# EAGLE design CoCoSDCExt (EAGLE 7.7.0)

## Sheet 1 of 4: LOGIC
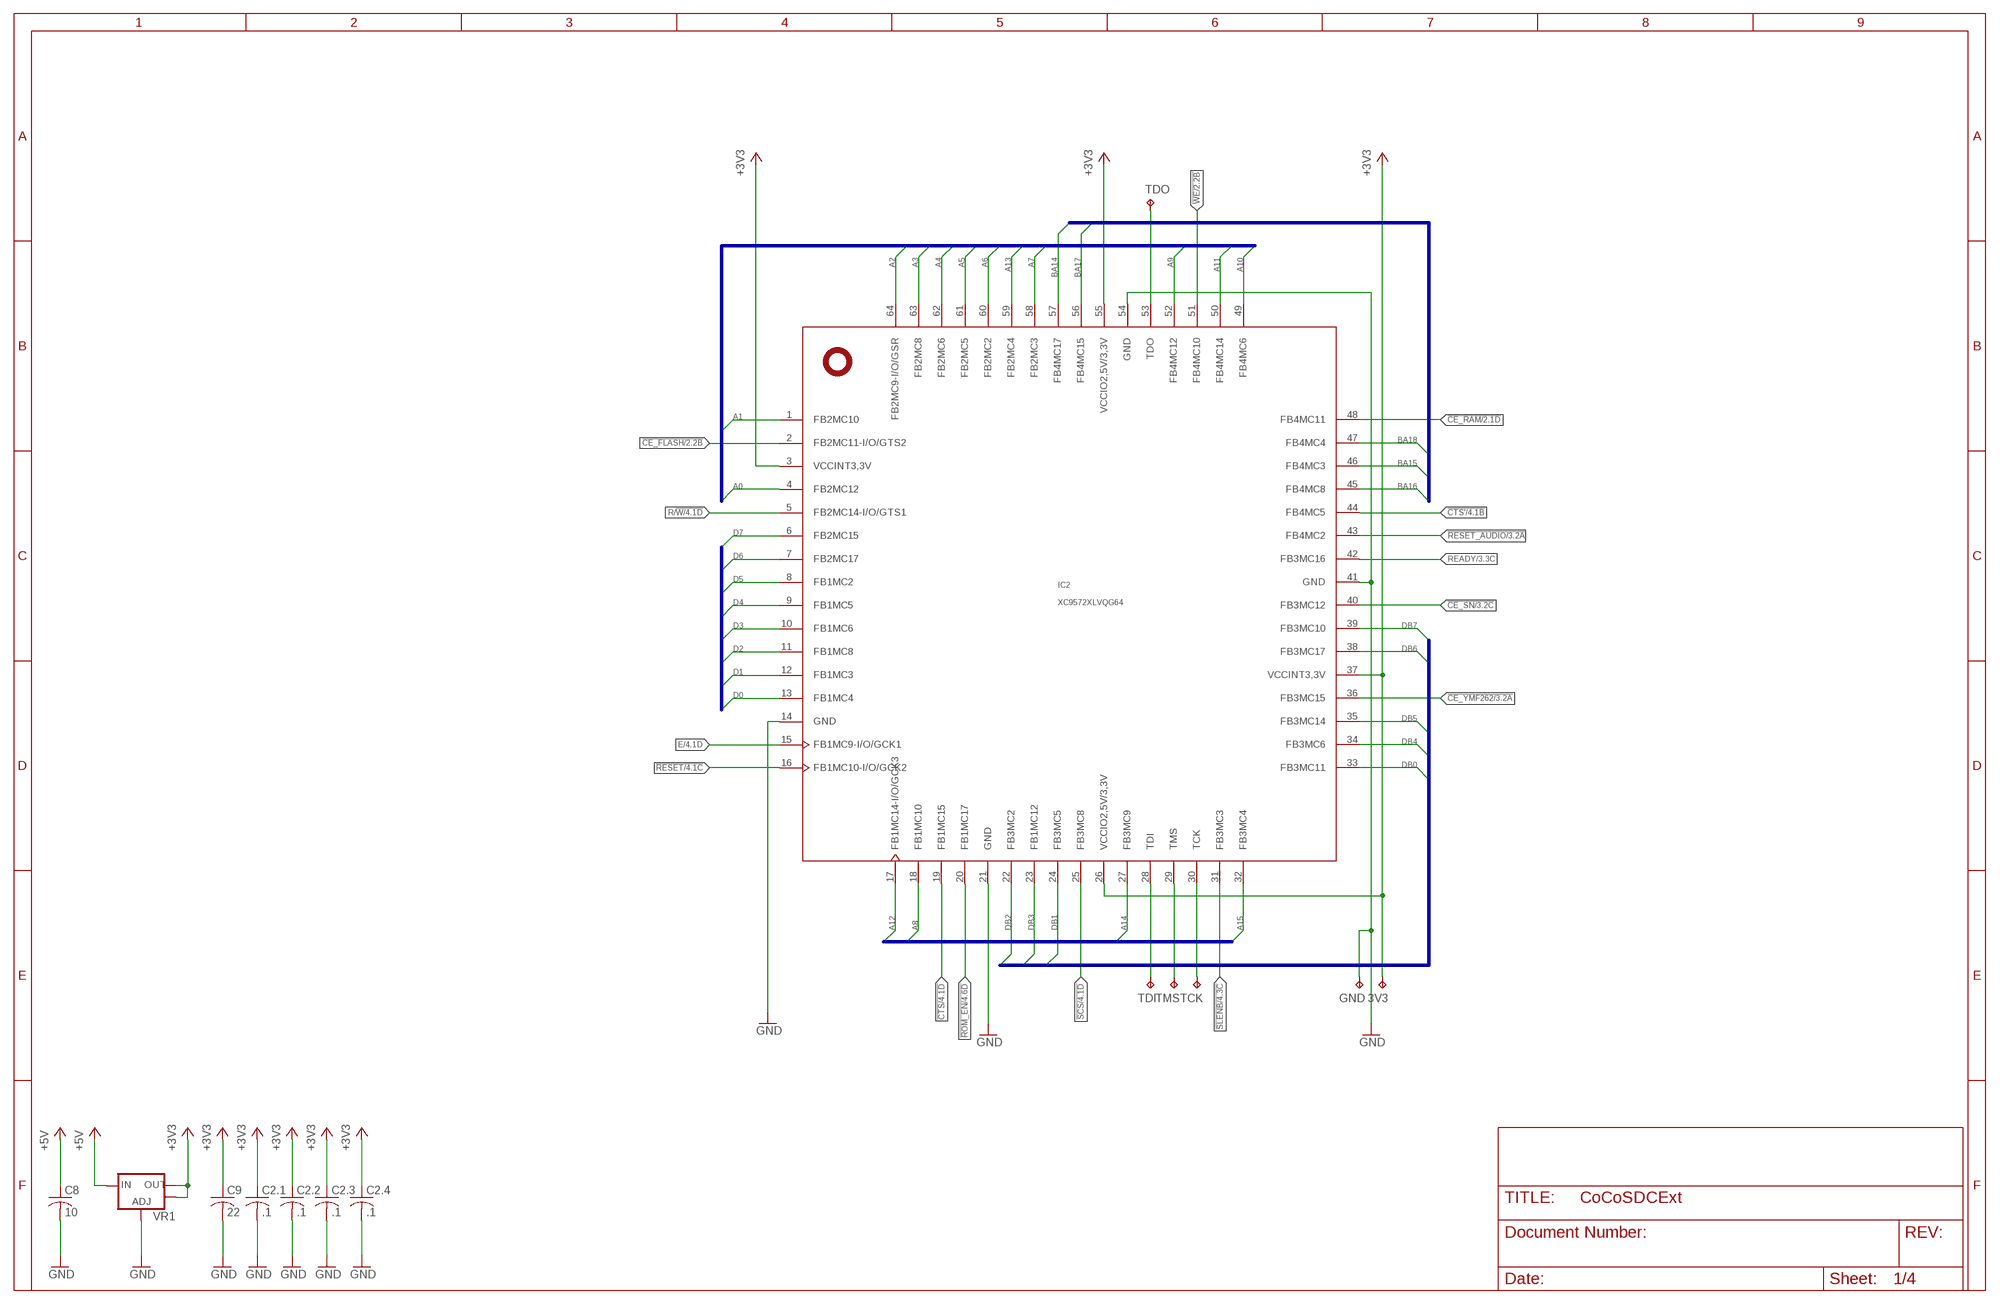
[diagram p0: schematic, sheet 1]

### Parts
3V3  TPTP08R  [TP08R]
C2.1  .1  C-USC0402  [C0402]
C2.2  .1  C-USC0402  [C0402]
C2.3  .1  C-USC0402  [C0402]
C2.4  .1  C-USC0402  [C0402]
C8  10  C-USC0805  [C0805]
C9  22  C-USC0805  [C0805]
GND  TPTP08R  [TP08R]
IC2  XC9572XLVQG64  [VQFP64]
TCK  TPTP08R  [TP08R]
TDI  TPTP08R  [TP08R]
TDO  TPTP08R  [TP08R]
TMS  TPTP08R  [TP08R]
VR1  V_REG_LM1117SOT223  [SOT223]

### Nets
!CE_FLASH: IC2.2(FB2MC11-I/O/GTS2) ; also sheet 2
!CE_RAM: IC2.48(FB4MC11) ; also sheet 2
!CE_SN: IC2.40(FB3MC12) ; also sheet 3,4
!CE_YMF262: IC2.36(FB3MC15) ; also sheet 3
!CTS: IC2.19(FB1MC15) ; also sheet 4
!CTS': IC2.44(FB4MC5) ; also sheet 4
!RESET: IC2.16(FB1MC10-I/O/GCK2) ; also sheet 4
!RESET_AUDIO: IC2.43(FB4MC2) ; also sheet 3
!ROM_EN: IC2.20(FB1MC17) ; also sheet 4
!SCS: IC2.25(FB3MC8) ; also sheet 4
!SLENB: IC2.31(FB3MC3) ; also sheet 4
!WE: IC2.51(FB4MC10) ; also sheet 2,3
+3V3: 3V3.TP C2.1.1 C2.2.1 C2.3.1 C2.4.1 C9.1 IC2.3(VCCINT3,3V) IC2.26(VCCIO2,5V/3,3V) IC2.37(VCCINT3,3V) IC2.55(VCCIO2,5V/3,3V) VR1.2(OUT) VR1.4(OUT) ; also sheet 3,4
+5V: C8.1 VR1.3(IN) ; also sheet 2,3,4
A0: IC2.4(FB2MC12) ; also sheet 2,3,4
A1: IC2.1(FB2MC10) ; also sheet 2,3,4
A2: IC2.64(FB2MC9-I/O/GSR) ; also sheet 2,4
A3: IC2.63(FB2MC8) ; also sheet 2,4
A4: IC2.62(FB2MC6) ; also sheet 2,4
A5: IC2.61(FB2MC5) ; also sheet 2,4
A6: IC2.60(FB2MC2) ; also sheet 2,4
A7: IC2.58(FB2MC3) ; also sheet 2,4
A8: IC2.18(FB1MC10) ; also sheet 2,4
A9: IC2.52(FB4MC12) ; also sheet 2,4
A10: IC2.49(FB4MC6) ; also sheet 2,4
A11: IC2.50(FB4MC14) ; also sheet 2,4
A12: IC2.17(FB1MC14-I/O/GCK3) ; also sheet 2,4
A13: IC2.59(FB2MC4) ; also sheet 2,4
A14: IC2.27(FB3MC9) ; also sheet 4
A15: IC2.32(FB3MC4) ; also sheet 4
BA14: IC2.57(FB4MC17) ; also sheet 2
BA15: IC2.46(FB4MC3) ; also sheet 2
BA16: IC2.45(FB4MC8) ; also sheet 2
BA17: IC2.56(FB4MC15) ; also sheet 2
BA18: IC2.47(FB4MC4) ; also sheet 2
D0: IC2.13(FB1MC4) ; also sheet 2,4
D1: IC2.12(FB1MC3) ; also sheet 2,4
D2: IC2.11(FB1MC8) ; also sheet 2,4
D3: IC2.10(FB1MC6) ; also sheet 2,4
D4: IC2.9(FB1MC5) ; also sheet 2,4
D5: IC2.8(FB1MC2) ; also sheet 2,4
D6: IC2.7(FB2MC17) ; also sheet 2,4
D7: IC2.6(FB2MC15) ; also sheet 2,4
DB0: IC2.33(FB3MC11) ; also sheet 3
DB1: IC2.24(FB3MC5) ; also sheet 3
DB2: IC2.22(FB3MC2) ; also sheet 3
DB3: IC2.23(FB1MC12) ; also sheet 3
DB4: IC2.34(FB3MC6) ; also sheet 3
DB5: IC2.35(FB3MC14) ; also sheet 3
DB6: IC2.38(FB3MC17) ; also sheet 3
DB7: IC2.39(FB3MC10) ; also sheet 3
E: IC2.15(FB1MC9-I/O/GCK1) ; also sheet 4
GND: C2.1.2 C2.2.2 C2.3.2 C2.4.2 C8.2 C9.2 GND.TP IC2.14(GND) IC2.21(GND) IC2.41(GND) IC2.54(GND) VR1.1(ADJ) ; also sheet 2,3,4
R/!W: IC2.5(FB2MC14-I/O/GTS1) ; also sheet 4
READY: IC2.42(FB3MC16) ; also sheet 3,4
TCK: IC2.30(TCK) TCK.TP
TDI: IC2.28(TDI) TDI.TP
TDO: IC2.53(TDO) TDO.TP
TMS: IC2.29(TMS) TMS.TP

### Buses
A[0..15]
D[0..7]
BA[14..18]
DB[0..7],AB[0..18],!RCE,!FCE,!WE

## Sheet 2 of 4: MEMORY
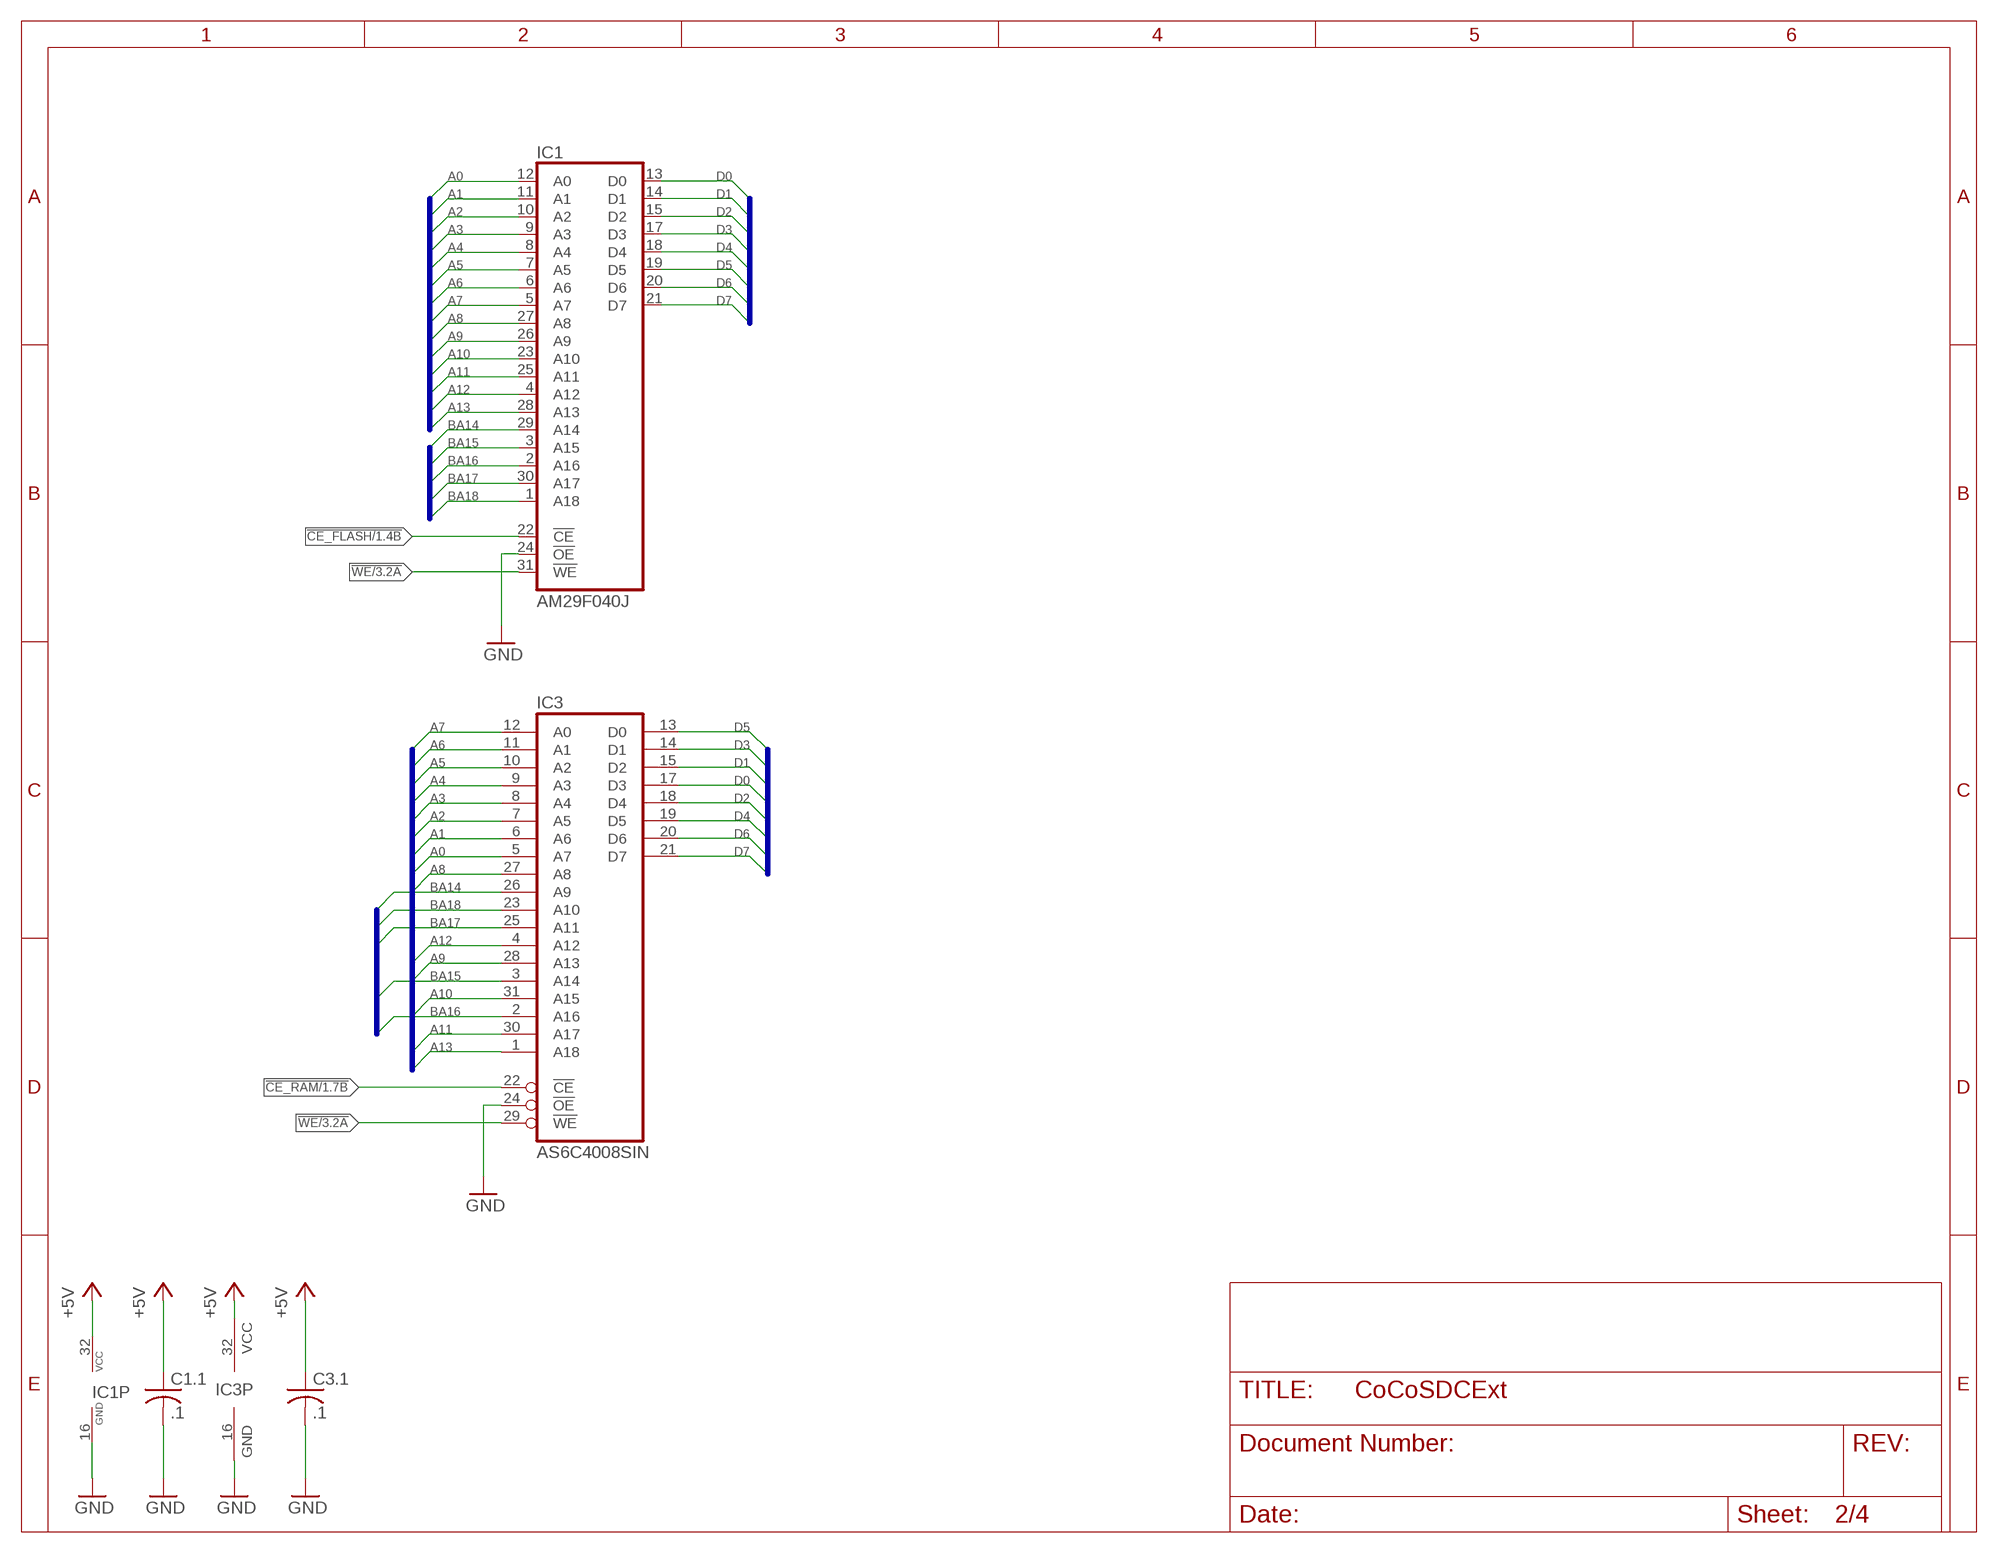
[diagram p1: schematic, sheet 2]

### Parts
C1.1  .1  C-USC0402  [C0402]
C3.1  .1  C-USC0402  [C0402]
IC1  AM29F040J  [PLCC32R]
IC3  AS6C4008SIN  [SOP32L]

### Nets
!CE_FLASH: IC1.22(!CE) ; also sheet 1
!CE_RAM: IC3.22(!CE) ; also sheet 1
!WE: IC1.31(!WE) IC3.29(!WE) ; also sheet 1,3
+5V: C1.1.1 C3.1.1 IC1.32(VCC) IC3.32(VCC) ; also sheet 1,3,4
A0: IC1.12(A0) IC3.5(A7) ; also sheet 1,3,4
A1: IC1.11(A1) IC3.6(A6) ; also sheet 1,3,4
A2: IC1.10(A2) IC3.7(A5) ; also sheet 1,4
A3: IC1.9(A3) IC3.8(A4) ; also sheet 1,4
A4: IC1.8(A4) IC3.9(A3) ; also sheet 1,4
A5: IC1.7(A5) IC3.10(A2) ; also sheet 1,4
A6: IC1.6(A6) IC3.11(A1) ; also sheet 1,4
A7: IC1.5(A7) IC3.12(A0) ; also sheet 1,4
A8: IC1.27(A8) IC3.27(A8) ; also sheet 1,4
A9: IC1.26(A9) IC3.28(A13) ; also sheet 1,4
A10: IC1.23(A10) IC3.31(A15) ; also sheet 1,4
A11: IC1.25(A11) IC3.30(A17) ; also sheet 1,4
A12: IC1.4(A12) IC3.4(A12) ; also sheet 1,4
A13: IC1.28(A13) IC3.1(A18) ; also sheet 1,4
BA14: IC1.29(A14) IC3.26(A9) ; also sheet 1
BA15: IC1.3(A15) IC3.3(A14) ; also sheet 1
BA16: IC1.2(A16) IC3.2(A16) ; also sheet 1
BA17: IC1.30(A17) IC3.25(A11) ; also sheet 1
BA18: IC1.1(A18) IC3.23(A10) ; also sheet 1
D0: IC1.13(D0) IC3.17(D3) ; also sheet 1,4
D1: IC1.14(D1) IC3.15(D2) ; also sheet 1,4
D2: IC1.15(D2) IC3.18(D4) ; also sheet 1,4
D3: IC1.17(D3) IC3.14(D1) ; also sheet 1,4
D4: IC1.18(D4) IC3.19(D5) ; also sheet 1,4
D5: IC1.19(D5) IC3.13(D0) ; also sheet 1,4
D6: IC1.20(D6) IC3.20(D6) ; also sheet 1,4
D7: IC1.21(D7) IC3.21(D7) ; also sheet 1,4
GND: C1.1.2 C3.1.2 IC1.16(GND) IC1.24(!OE) IC3.16(GND) IC3.24(!OE) ; also sheet 1,3,4

### Buses
A[0..15]
D[0..7]
BA[14..18]

## Sheet 3 of 4: AUDIO
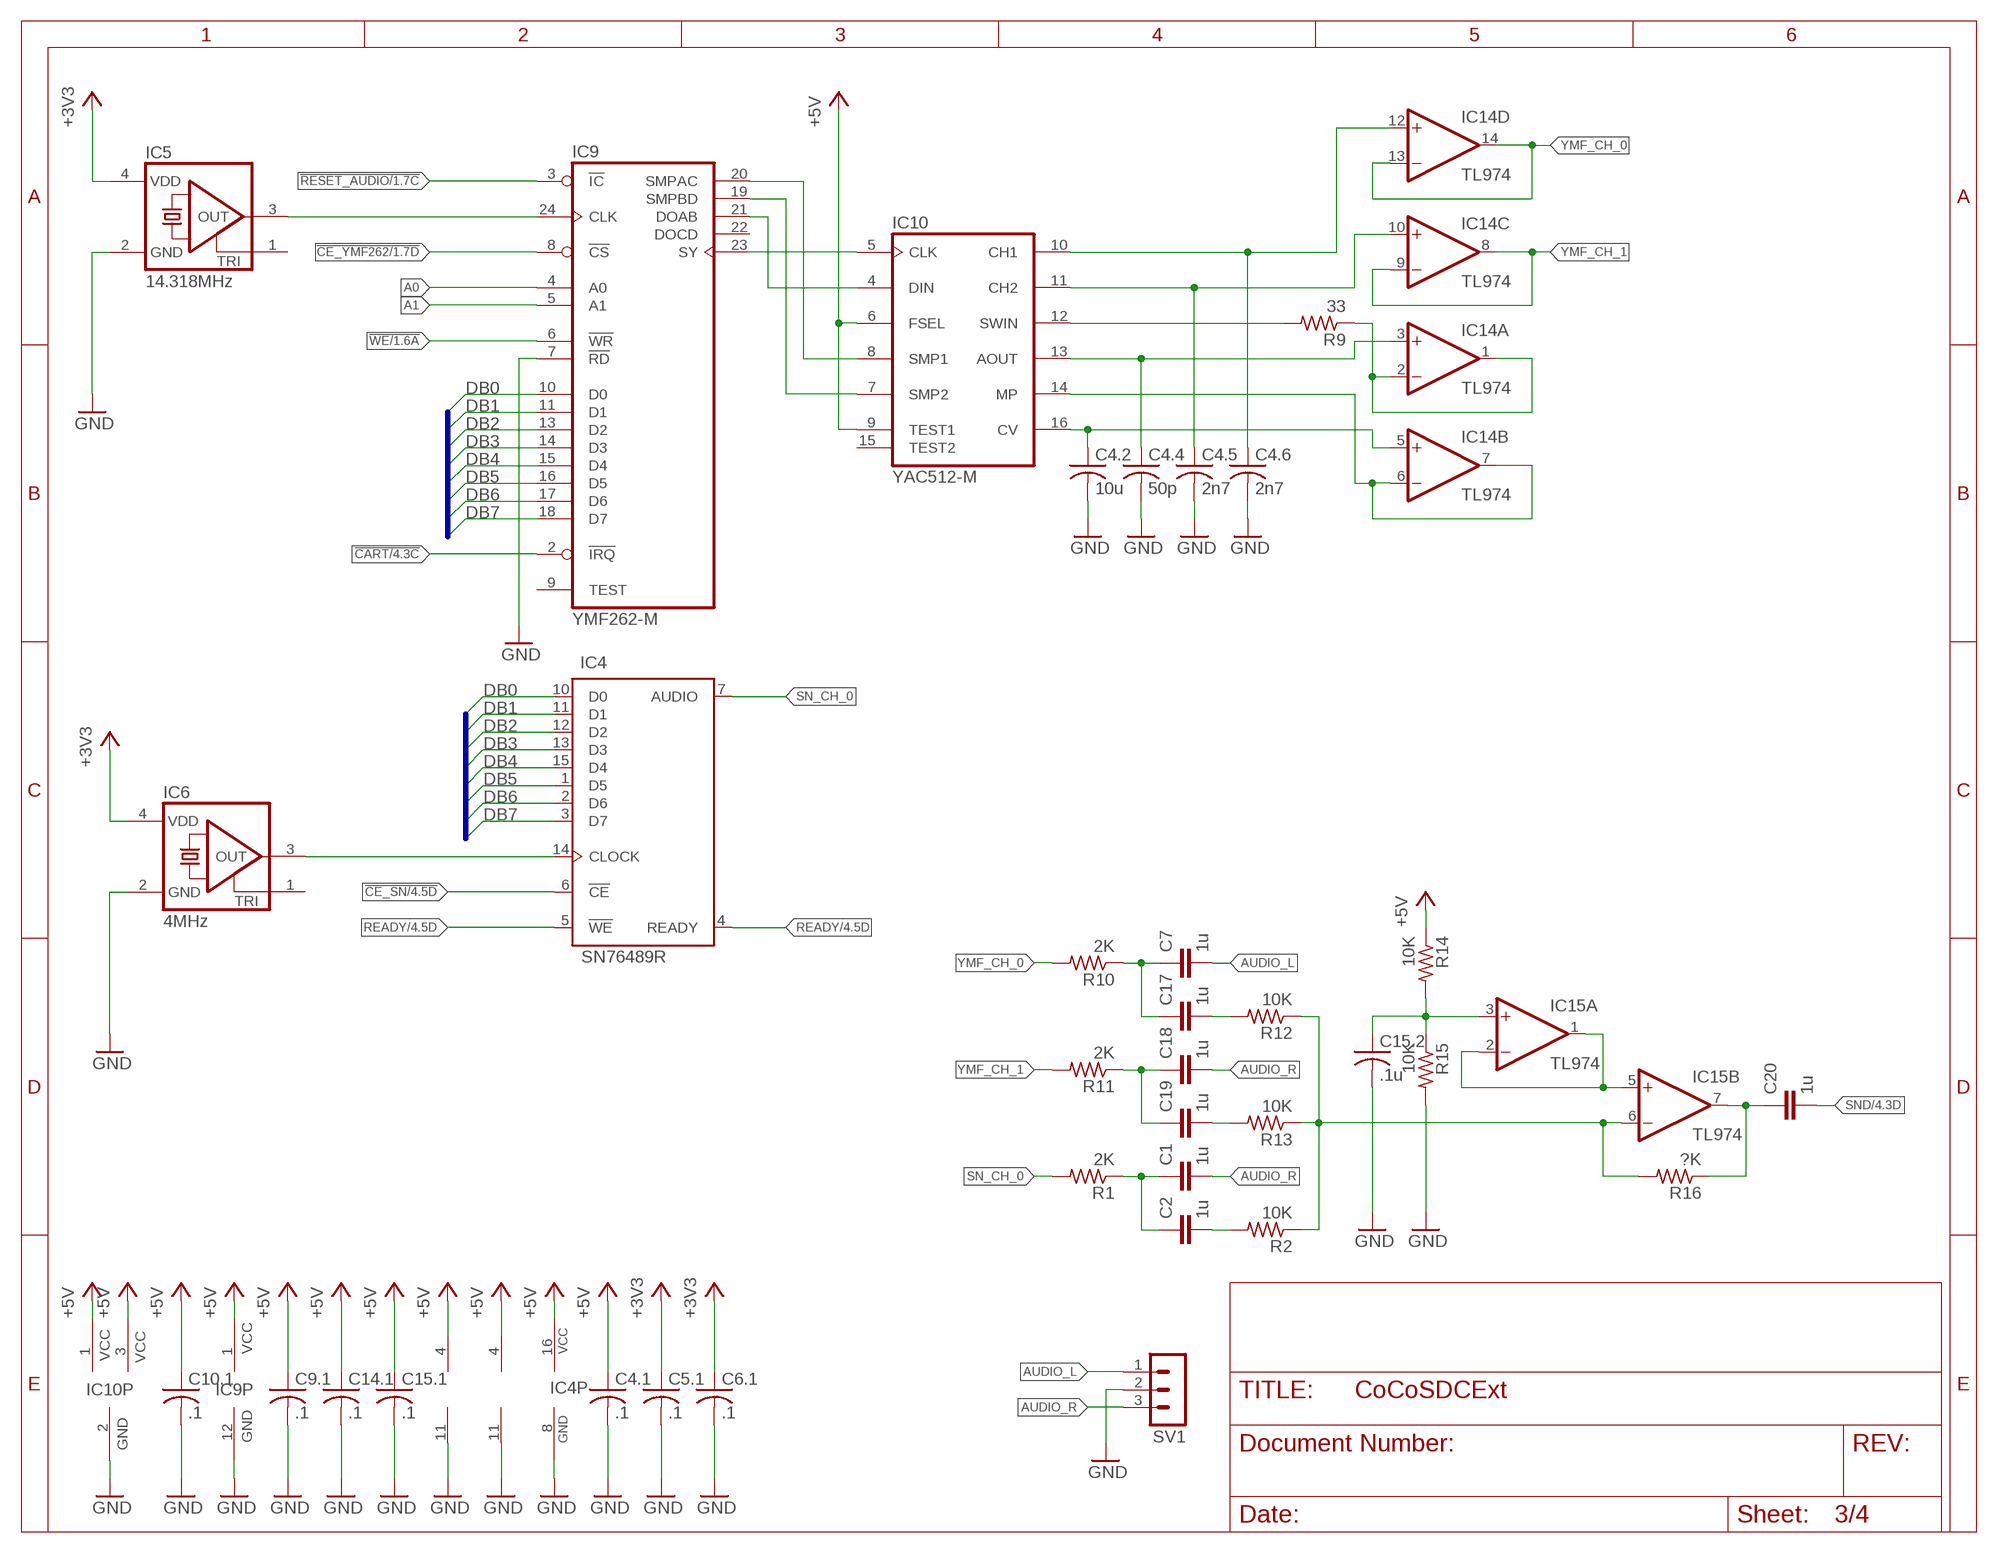
[diagram p2: schematic, sheet 3]

### Parts
C1  1u  C-BP-SMD-SV-B  [SV-B]
C2  1u  C-BP-SMD-SV-B  [SV-B]
C4.1  .1  C-USC0402  [C0402]
C4.2  10u  C-USC0805  [C0805]
C4.4  50p  C-USC0402  [C0402]
C4.5  2n7  C-USC0402  [C0402]
C4.6  2n7  C-USC0402  [C0402]
C5.1  .1  C-USC0402  [C0402]
C6.1  .1  C-USC0402  [C0402]
C7  1u  C-BP-SMD-SV-B  [SV-B]
C9.1  .1  C-USC0402  [C0402]
C10.1  .1  C-USC0402  [C0402]
C14.1  .1  C-USC0402  [C0402]
C15.1  .1  C-USC0402  [C0402]
C15.2  .1u  C-USC0402  [C0402]
C17  1u  C-BP-SMD-SV-B  [SV-B]
C18  1u  C-BP-SMD-SV-B  [SV-B]
C19  1u  C-BP-SMD-SV-B  [SV-B]
C20  1u  C-BP-SMD-SV-B  [SV-B]
IC4  SN76489R  [DIL16-RP]
IC5  14.318MHz  ASE  [ASE]
IC6  4MHz  ASE  [ASE]
IC9  YMF262-M  [SO24W]
IC10  YAC512-M  [SO16]
IC14  TL974  [TSSOP14]
IC15  TL974  [TSSOP14]
R1  2K  R-US_R1206  [R1206]
R2  10K  R-US_R1206  [R1206]
R9  33  R-US_R0402  [R0402]
R10  2K  R-US_R1206  [R1206]
R11  2K  R-US_R1206  [R1206]
R12  10K  R-US_R1206  [R1206]
R13  10K  R-US_R1206  [R1206]
R14  10K  R-US_R0402  [R0402]
R15  10K  R-US_R0402  [R0402]
R16  ?K  R-US_R1206  [R1206]
SV1  MA03-1  [MA03-1]

### Nets
!CART: IC9.2(!IRQ) ; also sheet 4
!CE_SN: IC4.6(!CE) ; also sheet 1,4
!CE_YMF262: IC9.8(!CS) ; also sheet 1
!RESET_AUDIO: IC9.3(!IC) ; also sheet 1
!WE: IC9.6(!WR) ; also sheet 1,2
+3V3: C5.1.1 C6.1.1 IC5.4(VDD) IC6.4(VDD) ; also sheet 1,4
+5V: C4.1.1 C9.1.1 C10.1.1 C14.1.1 C15.1.1 IC4.16(VCC) IC9.1(VCC) IC10.1(VCC) IC10.3(VCC) IC10.6(FSEL) IC10.9(TEST1) IC14.4(V+) IC15.4(V+) R14.1 ; also sheet 1,2,4
A0: IC9.4(A0) ; also sheet 1,2,4
A1: IC9.5(A1) ; also sheet 1,2,4
AUDIO_L: C7.+ SV1.1
AUDIO_R: C1.+ C18.+ SV1.3
DB0: IC4.10(D0) IC9.10(D0) ; also sheet 1
DB1: IC4.11(D1) IC9.11(D1) ; also sheet 1
DB2: IC4.12(D2) IC9.13(D2) ; also sheet 1
DB3: IC4.13(D3) IC9.14(D3) ; also sheet 1
DB4: IC4.15(D4) IC9.15(D4) ; also sheet 1
DB5: IC4.1(D5) IC9.16(D5) ; also sheet 1
DB6: IC4.2(D6) IC9.17(D6) ; also sheet 1
DB7: IC4.3(D7) IC9.18(D7) ; also sheet 1
GND: C4.1.2 C4.2.2 C4.4.2 C4.5.2 C4.6.2 C5.1.2 C6.1.2 C9.1.2 C10.1.2 C14.1.2 C15.1.2 C15.2.2 IC4.8(GND) IC5.2(GND) IC6.2(GND) IC9.7(!RD) IC9.12(GND) IC10.2(GND) IC14.11(V-) IC15.11(V-) R15.2 SV1.2 ; also sheet 1,2,4
N$1: IC4.14(CLOCK) IC6.3(OUT)
N$2: C1.- C2.- R1.1
N$3: C2.+ R2.2
N$6: IC9.23(SY) IC10.5(CLK)
N$7: IC9.21(DOAB) IC10.4(DIN)
N$9: C7.- C17.- R10.1
N$10: IC9.20(SMPAC) IC10.8(SMP1)
N$11: IC9.19(SMPBD) IC10.7(SMP2)
N$12: IC5.3(OUT) IC9.24(CLK)
N$13: C18.- C19.- R11.1
N$14: IC10.12(SWIN) R9.2
N$15: C17.+ R12.2
N$16: C19.+ R13.2
N$17: IC15.6(B:-IN) R2.1 R12.1 R13.1 R16.2
N$18: IC14.1(A:OUT) IC14.2(A:-IN) R9.1
N$19: C4.6.1 IC10.10(CH1) IC14.12(D:+IN)
N$20: C4.5.1 IC10.11(CH2) IC14.10(C:+IN)
N$21: IC15.1(A:OUT) IC15.2(A:-IN) IC15.5(B:+IN)
N$23: C4.4.1 IC10.13(AOUT) IC14.3(A:+IN)
N$24: C15.2.1 IC15.3(A:+IN) R14.2 R15.1
N$26: IC10.14(MP) IC14.6(B:-IN) IC14.7(B:OUT)
N$27: C20.- IC15.7(B:OUT) R16.1
N$28: C4.2.1 IC10.16(CV) IC14.5(B:+IN)
READY: IC4.4(READY) IC4.5(!WE) ; also sheet 1,4
SN_CH_0: IC4.7(AUDIO) R1.2
SND: C20.+ ; also sheet 4
YMF_CH_0: IC14.13(D:-IN) IC14.14(D:OUT) R10.2
YMF_CH_1: IC14.8(C:OUT) IC14.9(C:-IN) R11.2
Unconnected: IC5.1(TRI) IC6.1(TRI) IC9.9(TEST) IC9.22(DOCD) IC10.15(TEST2) IC15.8(C:OUT) IC15.9(C:-IN) IC15.10(C:+IN) IC15.12(D:+IN) IC15.13(D:-IN) IC15.14(D:OUT)

### Buses
DB[0..7],AB[0..18],!RCE,!FCE,!WE

## Sheet 4 of 4: IO
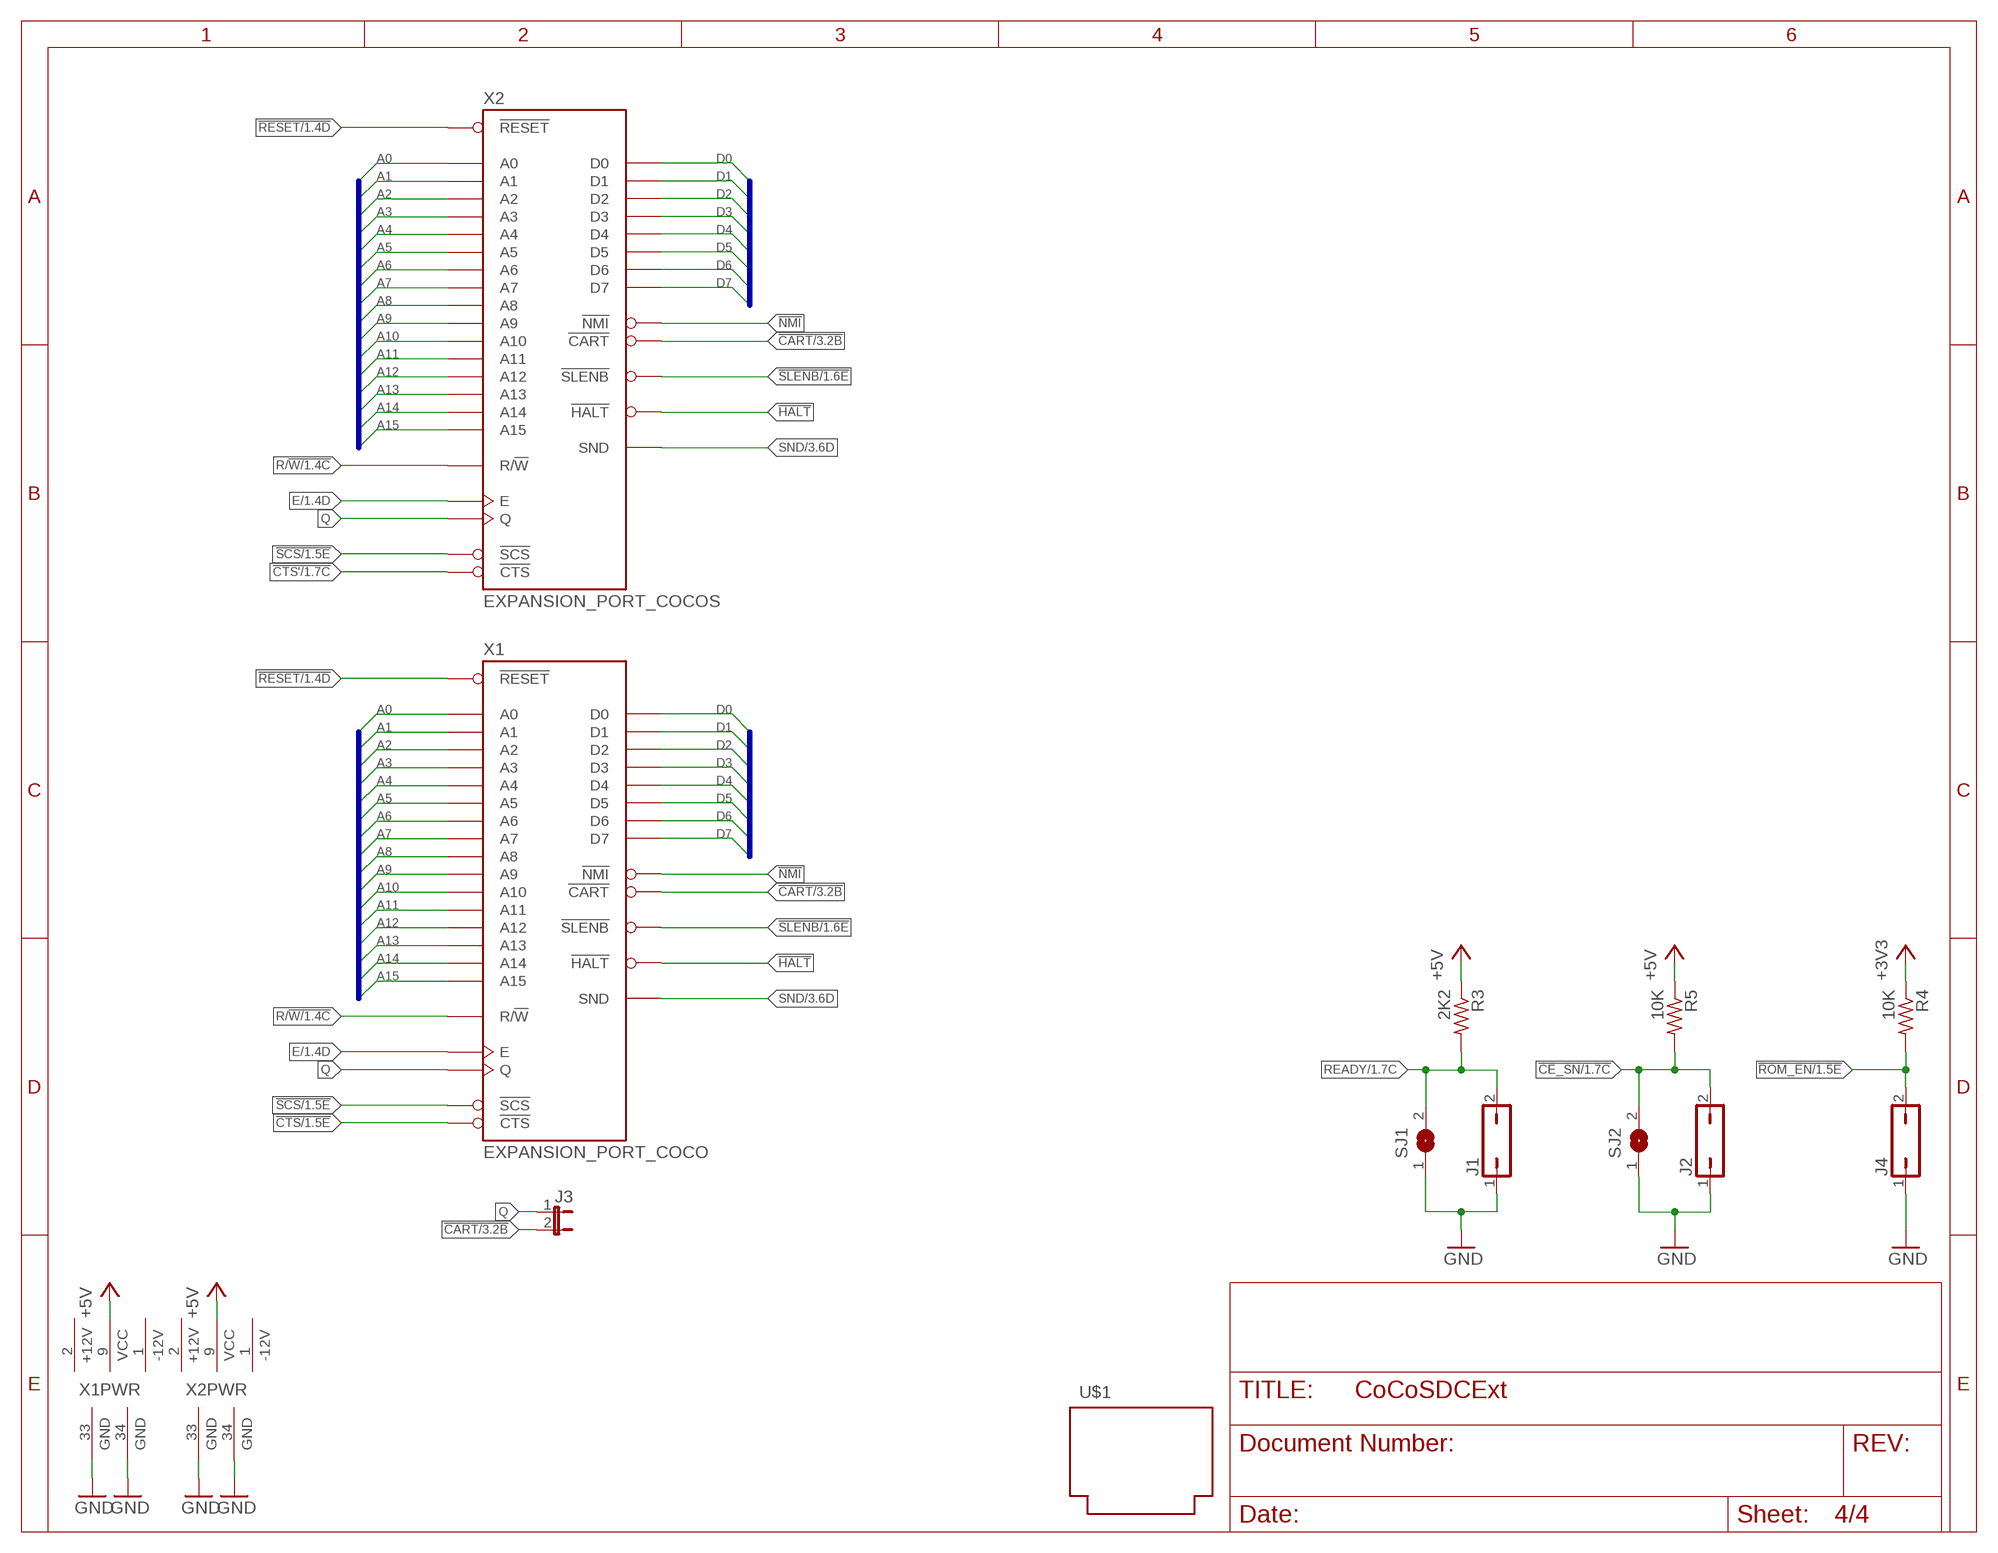
[diagram p3: schematic, sheet 4]

### Parts
J1  JP1Q  [JP1]
J2  JP1Q  [JP1]
J3  JP1E  [JP1]
J4  JP1Q  [JP1]
R3  2K2  R-US_R0402  [R0402]
R4  10K  R-US_R0402  [R0402]
R5  10K  R-US_R0402  [R0402]
SJ1  SJ  [SJ]
SJ2  SJ  [SJ]
U$1  PROGRAM_PAK  [PROGRAM_PAK]
X1  EXPANSION_PORT_COCO  [MA20-2]
X2  EXPANSION_PORT_COCOS  [MA20-2_SHORT]

### Nets
!CART: J3.2 X1.8(!CART) X2.8(!CART) ; also sheet 3
!CE_SN: J2.2 R5.2 SJ2.2 ; also sheet 1,3
!CTS: X1.32(!CTS) ; also sheet 1
!CTS': X2.32(!CTS) ; also sheet 1
!HALT: X1.3(!HALT) X2.3(!HALT)
!NMI: X1.4(!NMI) X2.4(!NMI)
!RESET: X1.5(!RESET) X2.5(!RESET) ; also sheet 1
!ROM_EN: J4.2 R4.2 ; also sheet 1
!SCS: X1.36(!SCS) X2.36(!SCS) ; also sheet 1
!SLENB: X1.40(!SLENB) X2.40(!SLENB) ; also sheet 1
+3V3: R4.1 ; also sheet 1,3
+5V: R3.1 R5.1 X1.9(VCC) X2.9(VCC) ; also sheet 1,2,3
A0: X1.19(A0) X2.19(A0) ; also sheet 1,2,3
A1: X1.20(A1) X2.20(A1) ; also sheet 1,2,3
A2: X1.21(A2) X2.21(A2) ; also sheet 1,2
A3: X1.22(A3) X2.22(A3) ; also sheet 1,2
A4: X1.23(A4) X2.23(A4) ; also sheet 1,2
A5: X1.24(A5) X2.24(A5) ; also sheet 1,2
A6: X1.25(A6) X2.25(A6) ; also sheet 1,2
A7: X1.26(A7) X2.26(A7) ; also sheet 1,2
A8: X1.27(A8) X2.27(A8) ; also sheet 1,2
A9: X1.28(A9) X2.28(A9) ; also sheet 1,2
A10: X1.29(A10) X2.29(A10) ; also sheet 1,2
A11: X1.30(A11) X2.30(A11) ; also sheet 1,2
A12: X1.31(A12) X2.31(A12) ; also sheet 1,2
A13: X1.37(A13) X2.37(A13) ; also sheet 1,2
A14: X1.38(A14) X2.38(A14) ; also sheet 1
A15: X1.39(A15) X2.39(A15) ; also sheet 1
D0: X1.10(D0) X2.10(D0) ; also sheet 1,2
D1: X1.11(D1) X2.11(D1) ; also sheet 1,2
D2: X1.12(D2) X2.12(D2) ; also sheet 1,2
D3: X1.13(D3) X2.13(D3) ; also sheet 1,2
D4: X1.14(D4) X2.14(D4) ; also sheet 1,2
D5: X1.15(D5) X2.15(D5) ; also sheet 1,2
D6: X1.16(D6) X2.16(D6) ; also sheet 1,2
D7: X1.17(D7) X2.17(D7) ; also sheet 1,2
E: X1.6(E) X2.6(E) ; also sheet 1
GND: J1.1 J2.1 J4.1 SJ1.1 SJ2.1 X1.33(GND) X1.34(GND) X2.33(GND) X2.34(GND) ; also sheet 1,2,3
Q: J3.1 X1.7(Q) X2.7(Q)
R/!W: X1.18(R/!W) X2.18(R/!W) ; also sheet 1
READY: J1.2 R3.2 SJ1.2 ; also sheet 1,3
SND: X1.35(SND) X2.35(SND) ; also sheet 3

### Buses
A[0..15]
D[0..7]

## Power pins joined to a net without a drawn wire
+12V: X1.2(+12V) X2.2(+12V)
-12V: X1.1(-12V) X2.1(-12V)

## Library data of the parts
3V3 GND TCK TDI TDO TMS = testpad:TP: Test pad
C1 C2 C7 C17-C20 = cap-pan40:C-BP: BIPOLAR ELECTROLYTIC
C1.1 C2.1-C2.4 C3.1 C5.1 C6.1 C8 C9 = resistor:C-US: CAPACITOR, American symbol
C4.1 C4.2 C4.4-C4.6 C9.1 C10.1 C14.1 C15.1 C15.2 = rcl:C-US: CAPACITOR, American symbol
IC1 = am29-memory:AM29F040J: 4-Megabit FLASH MEMORY (512 K x 8 bit) 5 V-only
IC2 = xilinx_xc95XXXxl:XC9572XLVQG64
IC3 = memory-alliance:AS6C4008
IC4 = texas-instruments:SN76489: Texas Instruments SN76489
IC5 IC6 = crystal:ASE: 3.3Vdc CMOS SMD CRYSTAL CLOCK OSCILLATOR SOurce: www.abracon.com; OC_FARNELL: unknown; OC_NEWARK: unknown
IC9 = yamaha:YMF262
IC10 = yamaha:YAC512
IC14 IC15 = linear-jlb:TL974
J1 J2 J4 = jumper-jlb:JP1Q: JUMPER
J3 = jumper-jlb:JP1E: JUMPER
R1-R5 R9-R16 = resistor:R-US_: RESISTOR, American symbol
SJ1 SJ2 = jumper:SJ: SMD solder JUMPER
SV1 = con-lstb-rp:MA03-1: PIN HEADER; OC_FARNELL: unknown; OC_NEWARK: unknown
U$1 = coco:PROGRAM_PAK
VR1 = SparkFun:V_REG_LM1117: Voltage Regulator LM1117 Standard adjustable voltage regulator but in SMD form. Spark Fun Electronics SKU : COM-00595
X1 X2 = coco:EXPANSION_PORT_COCO

## Board
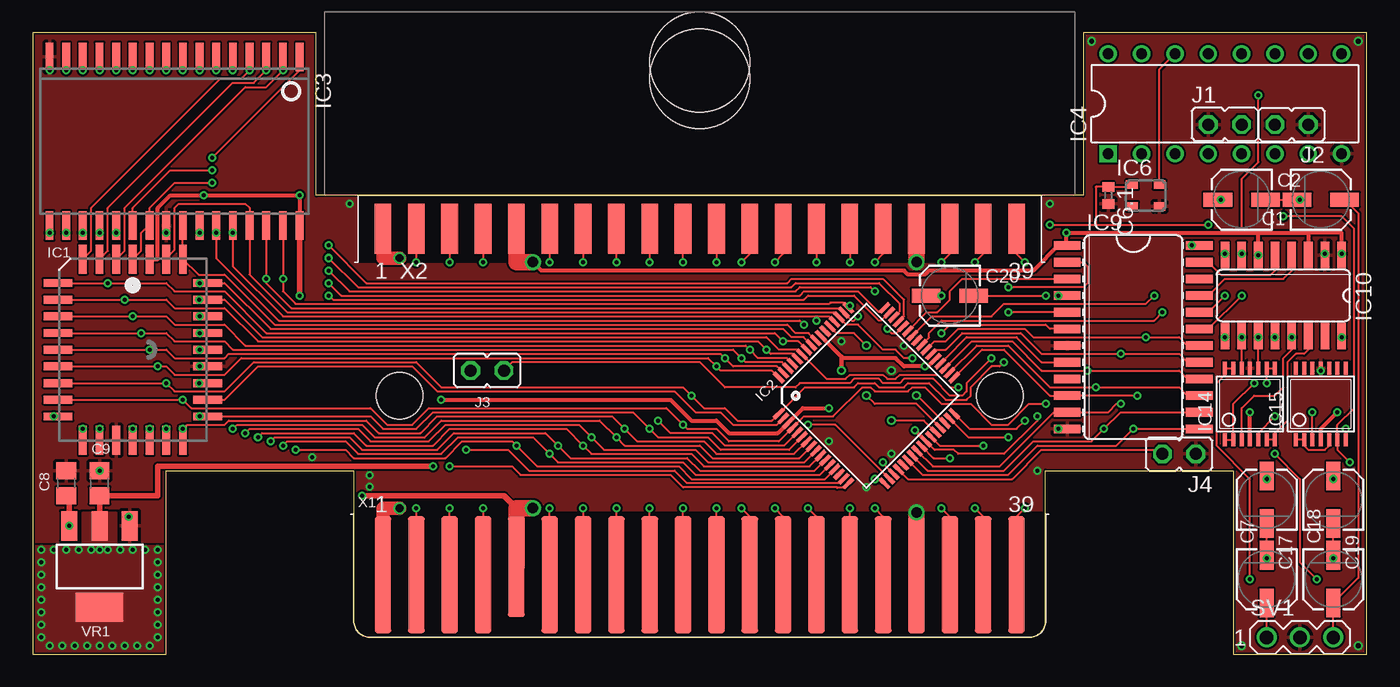
[diagram p4: board, top side]
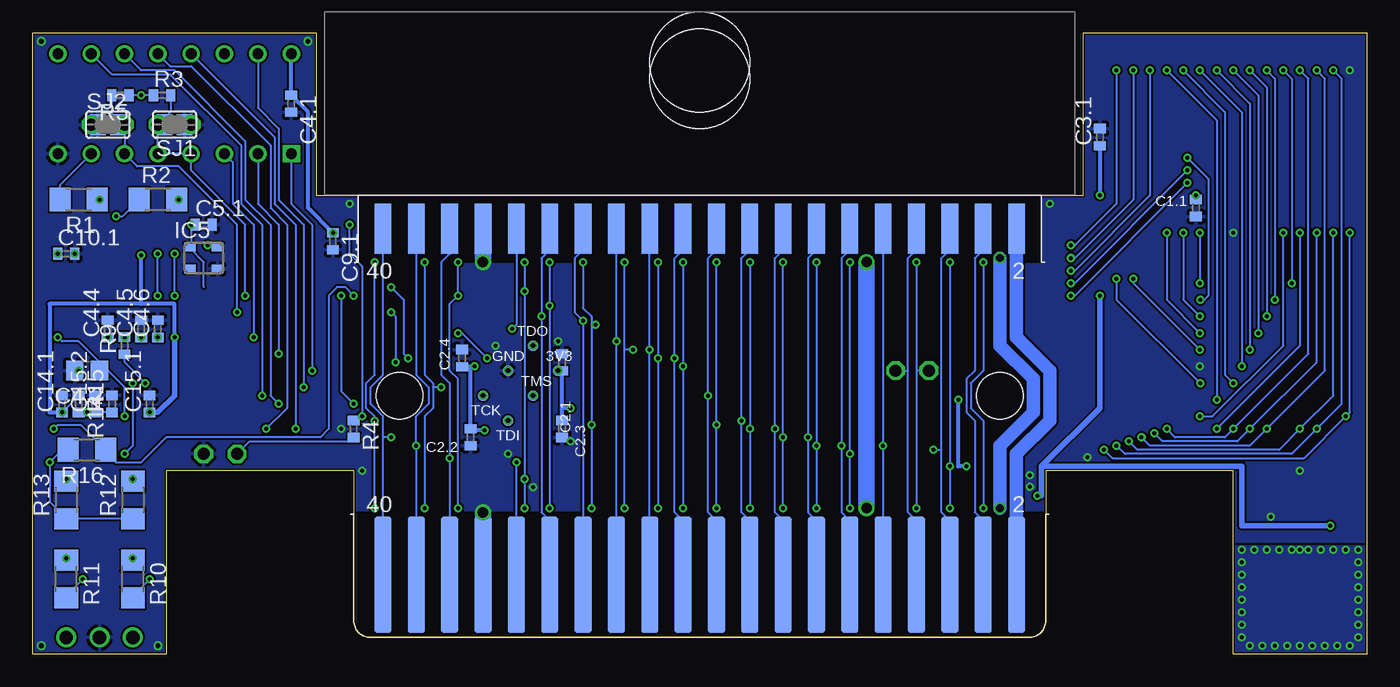
[diagram p5: board, bottom side, seen from below]

Size 101.6 x 47.31 mm. Coordinates in mm from the lower left corner, seen from the top.
Outline: 77.13,13.97 91.44,13.97 91.44,0 101.6,0 101.6,47.31 80.01,47.31 80.01,34.93 21.59,34.93 21.59,47.31 0,47.31 0,0 10.16,0 10.16,13.97 24.45,13.97 24.45,2.54 arc90 25.72,1.27 75.86,1.27 arc90 77.13,2.54 77.13,13.97
Copper layers (1*16): Top 0.035mm / dielectric 1.5mm / Bottom 0.035mm
Design rules "hackvana *": minimum track width 6mil, minimum drill 0.3mm, track to track 6mil, track to pad 6mil, pad to pad 6mil, via to via 6mil, smd to smd 0mil, copper to edge 6mil, drill to drill 6mil, minimum pad ring 10mil, minimum via ring 6mil, stop-mask expansion 2mil, vias tented up to drill 100mil, thermal gap 10mil

### Footprints (pad centres in the part's own frame; a part is rotated, then mirrored left to right if it is on the bottom)
TP08R = smd 0.8 x 0.8: TP 0,0
SV-B = smd 2.184 x 1.067: + -1.81,0; - 1.81,0
C0402 = smd 0.7 x 0.9: 1 -0.65,0; 2 0.65,0
C0805 = smd 1.3 x 1.5: 1 -0.95,0; 2 0.95,0
PLCC32R = smd 0.6 x 2.2: 1 0,6.9; 2 -1.27,6.9; 3 -2.54,6.9; 4 -3.81,6.9; 14 -3.81,-6.9; 15 -2.54,-6.9; 16 -1.27,-6.9; 17 0,-6.9; 18 1.27,-6.9; 19 2.54,-6.9; 20 3.81,-6.9; 30 3.81,6.9; 31 2.54,6.9; 32 1.27,6.9 | smd 2.2 x 0.6: 5 -5.7,5.08; 6 -5.7,3.81; 7 -5.7,2.54; 8 -5.7,1.27; 9 -5.7,0; 10 -5.7,-1.27; 11 -5.7,-2.54; 12 -5.7,-3.81; 13 -5.7,-5.08; 21 5.7,-5.08; 22 5.7,-3.81; 23 5.7,-2.54; 24 5.7,-1.27; 25 5.7,0; 26 5.7,1.27; 27 5.7,2.54; 28 5.7,3.81; 29 5.7,5.08
VQFP64 = smd 1 x 0.3: 1 -5.7,3.75; 2 -5.7,3.25; 3 -5.7,2.75; 4 -5.7,2.25; 5 -5.7,1.75; 6 -5.7,1.25; 7 -5.7,0.75; 8 -5.7,0.25; 9 -5.7,-0.25; 10 -5.7,-0.75; 11 -5.7,-1.25; 12 -5.7,-1.75; 13 -5.7,-2.25; 14 -5.7,-2.75; 15 -5.7,-3.25; 16 -5.7,-3.75; 33 5.7,-3.75; 34 5.7,-3.25; 35 5.7,-2.75; 36 5.7,-2.25; 37 5.7,-1.75; 38 5.7,-1.25; 39 5.7,-0.75; 40 5.7,-0.25; 41 5.7,0.25; 42 5.7,0.75; 43 5.7,1.25; 44 5.7,1.75; 45 5.7,2.25; 46 5.7,2.75; 47 5.7,3.25; 48 5.7,3.75 | smd 0.3 x 1: 17 -3.75,-5.7; 18 -3.25,-5.7; 19 -2.75,-5.7; 20 -2.25,-5.7; 21 -1.75,-5.7; 22 -1.25,-5.7; 23 -0.75,-5.7; 24 -0.25,-5.7; 25 0.25,-5.7; 26 0.75,-5.7; 27 1.25,-5.7; 28 1.75,-5.7; 29 2.25,-5.7; 30 2.75,-5.7; 31 3.25,-5.7; 32 3.75,-5.7; 49 3.75,5.7; 50 3.25,5.7; 51 2.75,5.7; 52 2.25,5.7; 53 1.75,5.7; 54 1.25,5.7; 55 0.75,5.7; 56 0.25,5.7; 57 -0.25,5.7; 58 -0.75,5.7; 59 -1.25,5.7; 60 -1.75,5.7; 61 -2.25,5.7; 62 -2.75,5.7; 63 -3.25,5.7; 64 -3.75,5.7
SOP32L = smd 0.6 x 2.2: 1 -9.525,-6.416; 2 -8.255,-6.416; 3 -6.985,-6.416; 4 -5.715,-6.416; 5 -4.445,-6.416; 6 -3.175,-6.416; 7 -1.905,-6.416; 8 -0.635,-6.416; 9 0.635,-6.416; 10 1.905,-6.416; 11 3.175,-6.416; 12 4.445,-6.416; 13 5.715,-6.416; 14 6.985,-6.416; 15 8.255,-6.416; 16 9.525,-6.416; 17 9.525,6.416; 18 8.255,6.416; 19 6.985,6.416; 20 5.715,6.416; 21 4.445,6.416; 22 3.175,6.416; 23 1.905,6.416; 24 0.635,6.416; 25 -0.635,6.416; 26 -1.905,6.416; 27 -3.175,6.416; 28 -4.445,6.416; 29 -5.715,6.416; 30 -6.985,6.416; 31 -8.255,6.416; 32 -9.525,6.416
DIL16-RP = drill 0.813 square: 1 -8.89,-3.81 | drill 0.813: 2 -6.35,-3.81; 3 -3.81,-3.81; 4 -1.27,-3.81; 5 1.27,-3.81; 6 3.81,-3.81; 7 6.35,-3.81; 8 8.89,-3.81; 9 8.89,3.81; 10 6.35,3.81; 11 3.81,3.81; 12 1.27,3.81; 13 -1.27,3.81; 14 -3.81,3.81; 15 -6.35,3.81; 16 -8.89,3.81
ASE = smd 0.9 x 0.65: 1 -1.05,-0.825; 2 1.05,-0.825; 3 1.05,0.825; 4 -1.05,0.825
SO24W = smd 0.66 x 2.032: 1 -6.985,-5.029; 2 -5.715,-5.029; 3 -4.445,-5.029; 4 -3.175,-5.029; 5 -1.905,-5.029; 6 -0.635,-5.029; 7 0.635,-5.029; 8 1.905,-5.029; 9 3.175,-5.029; 10 4.445,-5.029; 11 5.715,-5.029; 12 6.985,-5.029; 13 6.985,5.029; 14 5.715,5.029; 15 4.445,5.029; 16 3.175,5.029; 17 1.905,5.029; 18 0.635,5.029; 19 -0.635,5.029; 20 -1.905,5.029; 21 -3.175,5.029; 22 -4.445,5.029; 23 -5.715,5.029; 24 -6.985,5.029
SO16 = smd 0.66 x 2.032: 1 -4.445,-3.073; 2 -3.175,-3.073; 3 -1.905,-3.073; 4 -0.635,-3.073; 5 0.635,-3.073; 6 1.905,-3.073; 7 3.175,-3.073; 8 4.445,-3.073; 9 4.445,3.073; 10 3.175,3.073; 11 1.905,3.073; 12 0.635,3.073; 13 -0.635,3.073; 14 -1.905,3.073; 15 -3.175,3.073; 16 -4.445,3.073
TSSOP14 = smd 0.305 x 0.991: 1 -1.905,-2.718; 2 -1.27,-2.718; 3 -0.635,-2.718; 4 0,-2.718; 5 0.635,-2.718; 6 1.27,-2.718; 7 1.905,-2.718; 8 1.905,2.718; 9 1.27,2.718; 10 0.635,2.718; 11 0,2.718; 12 -0.635,2.718; 13 -1.27,2.718; 14 -1.905,2.718
JP1 = drill 0.914 octagon: 1 0,-1.27; 2 0,1.27
R1206 = smd 1.6 x 1.803: 1 -1.422,0; 2 1.422,0
R0402 = smd 0.7 x 0.9: 1 -0.65,0; 2 0.65,0
SJ = smd 1.168 x 1.6: 1 -0.762,0; 2 0.762,0
MA03-1 = drill 1.016: 1 -2.54,0; 2 0,0; 3 2.54,0
PROGRAM_PAK = hole 7.62: 0,1.27; 0,0 | hole 3.556: -22.86,-24.13; 22.86,-24.13
SOT223 = smd 1.219 x 2.235: 1 -2.311,-3.099; 2 0,-3.099; 3 2.311,-3.099 | smd 3.6 x 2.2: 4 0,3.099
MA20-2 = smd 1.27 x 8.89: 1 -24.13,-0.305; 3 -21.59,-0.305; 5 -19.05,-0.305; 7 -16.51,-0.305; 11 -11.43,-0.305; 13 -8.89,-0.305; 15 -6.35,-0.305; 17 -3.81,-0.305; 19 -1.27,-0.305; 21 1.27,-0.305; 23 3.81,-0.305; 25 6.35,-0.305; 27 8.89,-0.305; 29 11.43,-0.305; 31 13.97,-0.305; 33 16.51,-0.305; 35 19.05,-0.305; 37 21.59,-0.305; 39 24.13,-0.305 | smd 1.27 x 8.89 bottom: 2 -24.13,-0.305; 4 -21.59,-0.305; 6 -19.05,-0.305; 8 -16.51,-0.305; 10 -13.97,-0.305; 12 -11.43,-0.305; 14 -8.89,-0.305; 16 -6.35,-0.305; 18 -3.81,-0.305; 20 -1.27,-0.305; 22 1.27,-0.305; 24 3.81,-0.305; 26 6.35,-0.305; 28 8.89,-0.305; 30 11.43,-0.305; 32 13.97,-0.305; 34 16.51,-0.305; 36 19.05,-0.305; 38 21.59,-0.305; 40 24.13,-0.305 | smd 1.27 x 7.62: 9 -13.97,0.305
MA20-2_SHORT = smd 1.27 x 3.81: 1 -24.13,0; 3 -21.59,0; 5 -19.05,0; 7 -16.51,0; 9 -13.97,0; 11 -11.43,0; 13 -8.89,0; 15 -6.35,0; 17 -3.81,0; 19 -1.27,0; 21 1.27,0; 23 3.81,0; 25 6.35,0; 27 8.89,0; 29 11.43,0; 31 13.97,0; 33 16.51,0; 35 19.05,0; 37 21.59,0; 39 24.13,0 | smd 1.27 x 3.81 bottom: 2 -24.13,0; 4 -21.59,0; 6 -19.05,0; 8 -16.51,0; 10 -13.97,0; 12 -11.43,0; 14 -8.89,0; 16 -6.35,0; 18 -3.81,0; 20 -1.27,0; 22 1.27,0; 24 3.81,0; 26 6.35,0; 28 8.89,0; 30 11.43,0; 32 13.97,0; 34 16.51,0; 36 19.05,0; 38 21.59,0; 40 24.13,0

### Placement (x,y rotation side)
3V3  61.59,21.59 0 bottom
C1  98.11,34.61 180 top
C1.1  13.02,33.97 270 bottom
C2  92.07,34.61 0 top
C2.1  61.28,22.22 90 bottom
C2.2  68.26,16.51 270 bottom
C2.3  61.28,17.14 270 bottom
C2.4  68.9,22.54 90 bottom
C3.1  20.32,39.37 90 bottom
C4.1  81.91,41.91 270 bottom
C4.2  97.47,21.59 180 bottom
C4.4  95.88,24.77 90 bottom
C4.5  93.34,24.77 90 bottom
C4.6  92.07,24.77 90 bottom
C5.1  88.58,32.7 0 bottom
C6.1  81.91,34.93 270 top
C7  93.98,5.71 90 top
C8  2.54,13.02 90 top
C9  5.08,13.02 90 top
C9.1  78.74,31.43 270 bottom
C10.1  99.06,30.48 0 bottom
C14.1  99.38,19.05 90 bottom
C15.1  92.71,19.05 90 bottom
C15.2  96.84,19.05 90 bottom
C17  93.98,11.75 270 top
C18  99.06,5.71 90 top
C19  99.06,11.75 270 top
C20  69.85,27.3 0 top
GND  65.41,21.59 0 bottom
IC1  7.62,23.18 0 top
IC2  63.5,19.68 45 top
IC3  10.79,39.05 180 top
IC4  90.81,41.91 0 top
IC5  88.58,30.16 0 bottom
IC6  84.77,34.93 0 top
IC9  83.82,24.13 270 top
IC10  95.25,27.3 180 top
IC14  92.71,19.05 0 top
IC15  98.11,19.05 0 top
J1  90.81,40.32 270 top
J2  95.88,40.32 90 top
J3  34.61,21.59 270 top
J4  87.31,15.24 90 top
R1  98.11,34.61 180 bottom
R2  92.07,34.61 0 bottom
R3  91.76,42.55 0 bottom
R4  77.15,17.14 270 bottom
R5  94.93,42.55 180 bottom
R9  94.61,23.5 90 bottom
R10  93.98,5.71 270 bottom
R11  99.06,5.71 270 bottom
R12  93.98,11.75 90 bottom
R13  99.06,11.75 90 bottom
R14  98.11,19.05 270 bottom
R15  95.57,19.05 90 bottom
R16  97.47,15.56 180 bottom
SJ1  90.81,40.32 180 bottom
SJ2  95.88,40.32 0 bottom
SV1  96.52,1.27 0 top
TCK  67.31,19.68 0 bottom
TDI  65.41,17.78 0 bottom
TDO  63.5,23.5 0 bottom
TMS  63.5,19.68 0 bottom
U$1  50.8,43.82 0 top
VR1  5.08,6.67 180 top
X1  50.8,6.35 0 top
X2  50.8,32.38 0 top

### Tracks (layer width: path | path; a pad name or v marks a point on that pad's centre or on a via)
!CART  (via drill 0.3)
  Top 0.152: IC9.2 80.01,29.84 80.33,29.53 80.33,28.26 80.01,27.94 v74.3,27.94 | v73.03,22.54 71.12,20.64 71.12,20 70.8,19.68 69.85,19.68 68.58,20.95 66.36,20.95 66.04,20.64 64.77,20.64 64.45,20.95 62.55,20.95 62.23,20.64 58.42,20.64 58.1,20.32 52.7,20.32 50.8,22.22 36.51,22.22 J3.2
  Bottom 0.152: X1.8 34.29,10.16 34.92,10.79 34.92,21.59 | 34.92,21.59 34.92,30.16 34.29,30.8 X2.8 | J3.2 34.92,21.59 | v74.3,27.94 73.34,26.99 73.34,22.86 v73.03,22.54
!CE_FLASH
  Top 0.152: IC1.22 14.6,19.37 17.14,21.91 28.89,21.91 30.8,20 48.89,20 50.48,18.41 52.39,18.41 53.34,17.46 56.68,17.46 IC2.2
!CE_RAM  (via drill 0.3)
  Top 0.152: IC3.22 7.62,33.97 10.48,36.83 v13.65,36.83 | v22.54,28.26 23.49,27.3 58.42,27.3 58.74,27.62 62.86,27.62 64.45,26.04 64.55,26.04 IC2.48
  Bottom 0.152: v13.65,36.83 22.22,28.26 v22.54,28.26
!CE_SN  (via drill 0.3)
  Top 0.152: IC2.40 68.26,24.09 68.26,24.45 69.22,25.4 85.41,25.4 v86.04,26.04
  Bottom 0.152: v86.04,26.04 86.04,32.7 90.49,37.15 93.66,37.15 IC4.6 J2.2 SJ2.2 95.58,40.78 R5.2
!CE_YMF262
  Top 0.152: IC9.8 76.83,22.22 74.93,24.13 71.12,24.13 69.53,22.54 69.54,22.54 IC2.36
!CTS  (via drill 0.3)
  Top 0.152: IC2.19 64.77,14.53 v64.77,14.61
  Bottom 0.152: X1.32 v64.77,14.61
!CTS'  (via drill 0.3)
  Top 0.152: v65.09,24.77 65.41,24.45 65.79,24.45 IC2.44
  Bottom 0.152: X2.32 64.77,25.08 v65.09,24.77
!HALT  (via drill 0.3)
  Top 0.152: X2.3 v29.21,29.84 | v29.21,11.11 X1.3
  Bottom 0.152: v29.21,29.84 29.21,21.59 30.16,20.64 30.16,18.73 29.21,17.78 v29.21,11.11
!NMI
  Bottom 0.152: X2.4 29.21,30.8 29.84,30.16 29.84,21.59 30.48,20.95 30.48,18.41 29.84,17.78 29.84,10.79 29.21,10.16 X1.4
!RESET  (via drill 0.3)
  Top 0.152: X1.5 v31.75,11.11 | X2.5 v31.75,29.84 | v31.75,14.29 36.51,14.29 37.15,13.65 48.58,13.65 49.53,12.7 61.24,12.7 61.28,12.66 61.78,12.66 IC2.16
  Bottom 0.152: v31.75,29.84 v31.75,14.29 v31.75,11.11
!RESET_AUDIO
  Top 0.152: IC9.3 70.8,28.57 69.85,27.62 69.85,26.99 68.9,26.04 68.08,26.04 IC2.43
!ROM_EN
  Top 0.152: IC2.20 66.67,13.33 74.61,13.33 76.83,15.56 85.72,15.56 J4.2
  Bottom 0.152: R4.2 77.17,16.5 77.48,16.18 85.1,16.18 J4.2
!SCS  (via drill 0.3)
  Top 0.152: IC2.25 68.62,14.92 v69.85,14.92
  Bottom 0.152: X1.36 v69.85,14.92 69.85,20.64 70.48,21.27 70.48,29.84 69.85,30.48 X2.36
!SLENB  (via drill 0.3)
  Top 0.152: IC2.31 71.27,16.51 v74.3,16.51
  Bottom 0.152: X1.40 74.93,16.51 | X2.40 74.93,21.27 75.88,20.32 75.88,19.05 74.93,18.1 74.93,16.51 | v74.3,16.51 74.93,16.51
!WE  (via drill 0.3)
  Top 0.152: 10.16,29.21 IC1.31 10.16,30.16 10.79,30.8 10.79,33.97 11.11,34.29 16.19,34.29 16.51,33.97 IC3.29 | 16.51,31.75 IC3.29 | IC3.29 16.51,28.89 19.37,26.04 61.04,26.04 IC2.51 61.99,25.08 62.86,25.08 64.77,23.18 65.72,23.18 66.36,22.54 v66.99,22.54 | IC9.6 77.47,24.77 77.15,25.08 69.85,25.08 v69.22,24.45
  Bottom 0.152: v69.22,24.45 68.9,24.45 v66.99,22.54
+3V3  (via drill 0.3, 0.36)
  Top 0.152: v77.47,32.7 80.96,32.7 | 80.96,32.7 v89.53,32.7 | IC6.4 83.55,35.58 C6.1.1 80.96,35.58 80.96,32.7 | v76.52,18.1 76.52,17.78 73.98,15.24 70.48,15.24 70.17,15.56 68.69,15.56 IC2.26
  Top 0.305: IC2.26 v67.2,17.04 | IC2.55 61.59,22.65 3V3.TP 61.59,22.54 65.72,22.54 66.36,21.91 v67.94,21.91 68.2,21.91 IC2.37 | v60.64,18.73 58.66,18.73 IC2.3 56.75,16.83 53.02,16.83 52.07,17.78 50.16,17.78 48.58,19.37 v31.11,19.37
  Top 0.406: VR1.2 C9.1 9.52,12.07 9.52,14.29 v30.48,14.29
  Bottom 0.152: v77.47,32.7 77.47,30.48 76.52,29.53 v76.52,18.1 76.82,17.79 R4.1 | 88.58,27.95 88.58,29.84 89.63,30.89 IC5.4 89.53,30.89 v89.53,32.7 C5.1.1
  Bottom 0.305: v30.48,14.29 31.11,14.29 v31.11,19.37 | C2.3.1 61.28,18.73 | v60.64,18.73 61.28,18.73 | 61.28,18.73 C2.1.1 61.29,21.59 3V3.TP | 68.26,17.14 C2.2.1 | v67.2,17.04 68.26,17.04 C2.2.1 | v67.94,21.91 68.88,21.91 C2.4.1 68.26,21.89 C2.2.1
  other vias: 61.59,21.59 0.63,7.94 1.59,7.94 2.54,7.94 3.49,7.94 4.45,7.94 5.08,7.94 5.71,7.94 6.67,7.94 7.62,7.94 8.57,7.94 9.52,7.94 9.52,6.98 9.52,6.03 9.52,5.08 9.52,4.13 9.52,3.17 9.52,2.22 9.52,1.27 8.89,0.64 7.94,0.64 6.98,0.64 6.03,0.64 5.08,0.64 4.13,0.64 3.17,0.64 2.22,0.64 1.27,0.64 0.63,1.27 0.63,2.22 0.63,3.17 0.63,4.13 0.63,5.08 0.63,6.03 0.63,6.98
  pour Top (no thermals): 3.81,10.79 6.35,10.79 6.35,8.26 10.16,8.26 10.16,0 0,0 0,8.26 3.81,8.26
  pour Bottom: 0,8.26 0,0 10.16,0 10.16,8.26
+5V  (via drill 0.3, 0.8)
  Top 0.152: 92.07,32.07 92.07,36.2 93.34,37.47 v93.34,42.55
  Top 0.305: 93.34,32.07 97.16,32.07 | 97.16,32.07 IC10.3 | v99.69,30.48 99.69,32.07 97.16,32.07 | IC15.4 98.11,17.14 v99.38,18.41 | IC14.4 v92.71,18.41 | IC10.6 93.34,32.07 | 93.34,32.07 92.07,32.07 v78.74,32.07 78.74,31.17 78.16,31.17 76.2,29.21 68.26,29.21 67.94,28.89 66.67,28.89 66.36,29.21 38.73,29.21 v38.1,29.84 | IC1.32 9.52,30.08 9.52,33.97 10.48,34.93 v13.02,34.93 v20.32,34.93 IC3.32
  Top 0.406: IC10.1 v99.69,30.48 | IC10.9 v90.81,24.13 | IC9.1 78.74,31.17 | 2.77,10.48 VR1.3 2.86,9.77 2.86,10.48 2.77,10.48 | 2.77,10.48 2.77,12.07 C8.1 | v25.08,12.06 35.88,12.06 36.83,11.11 | IC3.32 v20.32,27.3
  Top 1.27: X1.9 36.83,11.11 v38.1,11.11 | X2.9 36.83,29.84 v38.1,29.84
  Bottom 0.152: C14.1.1 99.39,18.41 v99.38,18.41 98.11,19.68 R14.1 | R3.1 v93.34,42.55 R5.1
  Bottom 0.305: v92.71,18.41 C15.1.1 | v90.81,24.13 90.81,26.67 93.34,26.67 | 93.34,26.67 IC10.6 | 93.34,26.67 100.33,26.67 100.33,18.41 v99.38,18.41 | C1.1.1 v13.02,34.93 | C3.1.1 v20.32,34.93 | v99.69,30.48 C10.1.1 | v78.74,32.07 C9.1.1 78.75,32.08 80.64,33.97 80.64,41.29 C4.1.1 IC4.16
  Bottom 0.406: C15.1.1 92.69,18.41 92.07,18.41 90.81,19.68 v90.81,24.13 | v25.08,12.06 24.76,12.06 24.76,14.29 | 24.76,14.29 9.52,14.29 9.52,9.77 VR1.3 | v20.32,27.3 20.32,18.73 24.76,14.29
  Bottom 1.27: v38.1,11.11 v38.1,29.84
  other vias: 93.34,30.38 2.77,9.77
+12V
  Bottom 1.016: X1.2 26.67,15.24 24.13,17.78 24.13,21.59 26.67,24.13 X2.2
-12V  (via drill 0.6)
  Top 1.016: X2.1 26.67,30.16 v27.94,30.16 | v27.94,11.11 26.67,11.11 X1.1
  Bottom 1.016: v27.94,30.16 27.94,23.5 25.4,20.95 25.4,18.41 27.94,15.88 v27.94,11.11
A0  (via drill 0.3)
  Top 0.152: X1.19 v49.53,11.11 | v49.53,29.84 X2.19 | IC1.12 v11.43,19.37 12.06,18.73 25.72,18.73 26.99,17.46 28.89,17.46 30.16,18.73 48.26,18.73 v49.53,17.46 49.85,17.14 52.07,17.14 53.02,16.19 56.83,16.19 IC2.4 58.73,18.1 60.96,18.1 63.18,20.32 63.82,20.32 64.13,20 66.67,20 66.99,20.32 67.94,20.32 69.22,19.05 71.44,19.05 73.03,17.46 74.3,17.46 75.88,19.05 v77.15,19.05 | IC3.5 v15.24,44.45 | IC9.4 v78.1,27.3
  Bottom 0.152: v49.53,11.11 v49.53,17.46 v49.53,29.84 | v15.24,44.45 11.43,40.64 v11.43,19.37 | v78.1,27.3 78.1,20 v77.15,19.05
A1  (via drill 0.3)
  Top 0.152: IC1.11 v10.16,20.64 10.79,20 14.6,20 16.83,22.22 29.21,22.22 31.11,20.32 49.53,20.32 v50.16,19.68 51.12,18.73 52.7,18.73 53.66,17.78 56.29,17.78 IC2.1 58.83,20.32 62.55,20.32 62.86,20.64 64.13,20.64 64.45,20.32 66.36,20.32 66.67,20.64 68.26,20.64 69.53,19.37 71.12,19.37 71.44,19.68 71.44,20.32 73.03,21.91 73.66,21.91 v73.98,22.22 | IC3.6 v13.97,44.45 | IC9.5 v74.3,26.04
  Bottom 0.152: X1.20 49.53,10.16 50.16,10.79 v50.16,19.68 50.16,30.16 49.53,30.8 X2.20 | v13.97,44.45 10.79,41.28 10.79,21.27 v10.16,20.64 | v74.3,26.04 73.98,25.72 v73.98,22.22
A2  (via drill 0.3)
  Top 0.152: X2.21 v52.07,29.84 | X1.21 v52.07,11.11 | IC1.10 v9.52,21.91 10.16,21.91 10.79,21.27 14.6,21.27 15.88,22.54 51.43,22.54 v52.07,21.91 52.39,21.59 56.29,21.59 IC2.64 | IC3.7 v12.7,44.45
  Bottom 0.152: v52.07,29.84 v52.07,21.91 v52.07,11.11 | v12.7,44.45 9.52,41.28 v9.52,21.91
A3  (via drill 0.3)
  Top 0.152: IC1.9 v8.89,23.18 10.16,23.18 10.79,22.54 14.6,22.54 14.92,22.86 52.39,22.86 v52.7,22.54 53.34,21.91 56.68,21.91 IC2.63 | IC3.8 v11.43,44.45
  Bottom 0.152: X1.22 52.07,10.16 52.7,10.79 v52.7,22.54 52.7,30.16 52.07,30.8 X2.22 | v11.43,44.45 8.89,41.91 v8.89,23.18
A4  (via drill 0.3)
  Top 0.152: X2.23 54.61,30.48 v53.97,29.84 | X1.23 54.61,10.48 v53.97,11.11 | IC1.8 v8.25,24.45 10.16,24.45 10.79,23.81 14.6,23.81 15.24,23.18 53.34,23.18 v53.97,22.54 54.29,22.22 57.07,22.22 IC2.62 | IC3.9 v10.16,44.45
  Bottom 0.152: v53.97,29.84 v53.97,22.54 v53.97,11.11 | v10.16,44.45 8.25,42.55 v8.25,24.45
A5  (via drill 0.3)
  Top 0.152: IC1.7 v7.62,25.72 10.16,25.72 10.79,25.08 14.6,25.08 16.19,23.5 54.29,23.5 v54.61,23.18 55.24,22.54 57.46,22.54 IC2.61 | IC3.10 v8.89,44.45
  Bottom 0.152: X1.24 v54.61,23.18 X2.24 | v8.89,44.45 7.62,43.18 v7.62,25.72
A6  (via drill 0.3)
  Top 0.152: X1.25 57.15,10.48 v56.52,11.11 | X2.25 57.15,30.48 v56.52,29.84 | IC1.6 v6.98,26.99 10.16,26.99 10.79,26.35 14.6,26.35 17.14,23.81 55.24,23.81 v55.88,23.18 56.2,22.86 57.85,22.86 IC2.60 | IC3.11 v7.62,44.45
  Bottom 0.152: v56.52,11.11 56.52,23.18 | v55.88,23.18 56.52,23.18 | 56.52,23.18 v56.52,29.84 | v7.62,44.45 6.98,43.82 v6.98,26.99
A7  (via drill 0.3)
  Top 0.152: IC1.5 v5.71,28.26 10.16,28.26 10.79,27.62 14.6,27.62 17.78,24.45 56.52,24.45 v57.15,23.81 58.31,23.81 IC2.58 | IC3.12 v6.35,44.45
  Bottom 0.152: X1.26 v57.15,23.81 X2.26 | v6.35,44.45 5.71,43.82 v5.71,28.26
A8  (via drill 0.3)
  Top 0.152: X1.27 59.69,10.48 v59.05,11.11 | X2.27 v59.69,29.84 | v12.7,25.72 IC1.27 | IC3.27 v13.97,32.07 13.97,30.16 18.73,25.4 58.42,25.4 v58.74,25.08 | IC2.18 61.13,17.46 v59.05,17.46
  Bottom 0.152: v59.69,29.84 59.69,26.35 59.05,25.72 59.05,25.08 | 59.05,25.08 v59.05,17.46 v59.05,11.11 | v13.97,32.07 13.97,26.99 v12.7,25.72 | v58.74,25.08 59.05,25.08
A9  (via drill 0.3)
  Top 0.152: v12.7,24.45 IC1.26 | IC3.28 v15.24,32.07 15.24,29.53 19.05,25.72 59.69,25.72 | 59.69,25.72 60.65,25.72 | 60.65,25.72 IC2.52 | 60.65,25.72 60.65,25.71 | v59.69,25.4 59.69,25.72
  Bottom 0.152: X2.28 59.69,30.8 60.32,30.16 60.32,26.04 v59.69,25.4 X1.28 | v15.24,32.07 15.24,26.99 v12.7,24.45
A10  (via drill 0.3)
  Top 0.152: X1.29 v62.23,11.11 | X2.29 v62.23,29.84 | IC3.31 v19.05,28.57 19.05,27.62 20,26.67 60.64,26.67 60.74,26.77 61.72,26.77 IC2.49 62.12,26.4 v62.23,26.51 | v12.68,20.64 IC1.23
  Bottom 0.152: v62.23,29.84 v62.23,26.51 v62.23,11.11 | v19.05,28.57 19.05,27 v12.68,20.64
A11  (via drill 0.3)
  Top 0.152: v12.7,23.18 IC1.25 | IC3.30 v17.78,28.57 17.78,28.26 19.68,26.35 61.43,26.35 IC2.50 62.38,25.4 62.55,25.4 v62.86,25.72
  Bottom 0.152: X2.30 62.23,30.8 62.86,30.16 v62.86,25.72 62.86,10.79 62.23,10.16 X1.30 | v17.78,28.57 17.78,28.26 v12.7,23.18
A12  (via drill 0.3)
  Top 0.152: X2.31 64.77,30.48 v64.13,29.84 | X1.31 64.77,10.48 v64.13,11.11 | IC1.4 4.45,30.71 4.45,33.97 14.29,43.82 15.88,43.82 v16.51,44.45 IC3.4 | v22.54,29.21 24.13,27.62 58.1,27.62 58.42,27.94 63.82,27.94 v64.13,27.62 | IC2.17 64.55,13.33 v64.13,13.33
  Bottom 0.152: v64.13,29.84 v64.13,27.62 v64.13,13.33 v64.13,11.11 | v16.51,44.45 16.51,34.93 22.22,29.21 v22.54,29.21
A13  (via drill 0.3)
  Top 0.152: X2.37 72.39,30.48 v71.75,29.84 | X1.37 72.39,10.48 v71.75,11.11 | IC3.1 20.32,44.45 v13.65,37.78 | v70.48,20.32 69.85,20.32 68.9,21.27 66.04,21.27 65.72,20.95 65.09,20.95 64.77,21.27 62.23,21.27 61.91,20.95 60.46,20.95 IC2.59 58.24,23.18 56.83,23.18 55.88,24.13 17.46,24.13 14.6,26.99 IC1.28 v12.68,26.99
  Bottom 0.152: v71.75,29.84 71.75,21.27 71.12,20.64 71.12,20.32 | 71.12,20.32 71.12,18.73 71.75,18.1 v71.75,11.11 | v13.65,37.78 12.06,36.2 12.06,27.3 12.38,26.99 v12.68,26.99 | v70.48,20.32 71.12,20.32
A14  (via drill 0.3)
  Top 0.152: v72.39,15.88 69.08,15.88 IC2.27
  Bottom 0.152: X2.38 72.39,21.27 71.44,20.32 71.44,19.05 72.39,18.1 v72.39,15.88 X1.38
A15  (via drill 0.3)
  Top 0.152: X1.39 74.93,10.48 v75.56,11.11 | X2.39 74.93,30.48 v75.56,29.84 | IC2.32 71.34,17.14 74.93,17.14 v75.56,17.78
  Bottom 0.152: v75.56,11.11 v75.56,17.78 75.56,18.1 76.2,18.73 76.2,20.64 75.56,21.27 v75.56,29.84
AUDIO_L
  Top 0.152: SV1.1 C7.+
AUDIO_R
  Top 0.152: SV1.3 C18.+ 100.97,5.81 100.97,33.56 C1.+
BA14  (via drill 0.3)
  Top 0.152: v12.7,28.26 IC1.29 14.6,28.26 18.1,24.77 57.15,24.77 57.78,24.13 58.7,24.13 IC2.57 | v12.7,32.07 IC3.26
  Bottom 0.152: v12.7,32.07 v12.7,28.26
BA15  (via drill 0.3)
  Top 0.152: IC1.3 5.71,30.71 5.71,33.97 15.24,43.5 16.83,43.5 v17.78,44.45 IC3.3 | v22.54,30.16 24.76,27.94 57.78,27.94 58.1,28.26 64.45,28.26 66.04,26.67 66.04,26.11 IC2.46
  Bottom 0.152: v17.78,44.45 17.78,34.61 22.22,30.16 v22.54,30.16
BA16  (via drill 0.3)
  Top 0.152: IC1.2 6.98,30.71 6.98,33.97 16.19,43.18 17.78,43.18 v19.05,44.45 IC3.2 | v22.54,31.11 25.4,28.26 57.47,28.26 57.78,28.57 64.77,28.57 66.36,26.99 66.36,25.72 IC2.45
  Bottom 0.152: v19.05,44.45 19.05,34.29 22.22,31.11 v22.54,31.11
BA17
  Top 0.152: IC3.25 IC1.30 12.61,28.89 14.6,28.89 18.41,25.08 57.47,25.08 58.1,24.45 59.09,24.45 IC2.56
BA18  (via drill 0.3)
  Top 0.152: IC1.1 8.25,30.71 8.25,32.07 8.89,32.7 | IC3.23 8.89,32.7 | 8.89,32.7 8.89,33.97 10.79,35.88 v13.65,35.88 | v22.54,27.3 22.86,26.99 58.74,26.99 59.05,27.3 62.55,27.3 64.45,25.4 64.62,25.4 IC2.47
  Bottom 0.152: v13.65,35.88 22.22,27.3 v22.54,27.3
D0  (via drill 0.3)
  Top 0.152: v20,15.56 23.81,15.56 24.45,14.92 31.43,14.92 32.7,16.19 36.51,16.19 v36.83,15.88 38.42,14.29 49.21,14.29 50.16,13.33 60.33,13.33 IC2.13 | v1.59,18.1 IC1.13 | v1.27,32.07 IC3.17
  Bottom 0.152: X2.10 v36.83,15.88 X1.10 | v20,15.56 19.37,14.92 4.76,14.92 v1.59,18.1 1.27,18.41 v1.27,32.07
D1  (via drill 0.3)
  Top 0.152: X1.11 v39.37,11.11 | X2.11 v39.37,29.84 | IC1.14 v3.81,17.14 | v19.05,15.88 19.37,16.19 23.81,16.19 24.76,15.24 31.11,15.24 32.38,16.51 38.1,16.51 v39.37,15.24 40,14.61 49.53,14.61 50.48,13.65 59.94,13.65 IC2.12 | v2.54,44.45 IC3.15
  Bottom 0.152: v39.37,11.11 v39.37,15.24 v39.37,29.84 | v19.05,15.88 18.41,15.24 5.71,15.24 v3.81,17.14 1.9,19.05 1.9,43.82 v2.54,44.45
D2  (via drill 0.3)
  Top 0.152: IC1.15 v5.08,17.14 | v18.1,16.19 18.41,16.51 24.13,16.51 25.08,15.56 30.8,15.56 32.07,16.83 39.05,16.83 v40,15.88 40.96,14.92 49.85,14.92 50.8,13.97 59.55,13.97 IC2.11 | v2.54,32.07 IC3.18
  Bottom 0.152: X2.12 39.37,30.8 40,30.16 v40,15.88 40,10.79 39.37,10.16 X1.12 | v18.1,16.19 17.46,15.56 6.67,15.56 v5.08,17.14 2.54,19.68 v2.54,32.07
D3  (via drill 0.3)
  Top 0.152: X2.13 v41.91,29.84 | v41.91,11.11 X1.13 | IC1.17 v7.62,17.14 | v17.14,16.51 17.46,16.83 24.45,16.83 25.4,15.88 30.48,15.88 31.75,17.14 40.64,17.14 v41.91,15.88 42.54,15.24 50.16,15.24 51.12,14.29 59.16,14.29 IC2.10 | v3.81,44.45 IC3.14
  Bottom 0.152: v41.91,29.84 v41.91,15.88 v41.91,11.11 | v17.14,16.51 16.51,15.88 8.89,15.88 v7.62,17.14 3.17,21.59 3.17,43.82 v3.81,44.45
D4  (via drill 0.3)
  Top 0.152: IC1.18 v8.89,17.14 | v16.19,16.83 16.51,17.14 24.76,17.14 25.72,16.19 30.16,16.19 31.43,17.46 41.59,17.46 v42.54,16.51 43.5,15.56 50.48,15.56 51.43,14.61 58.77,14.61 IC2.9 | v3.81,32.07 IC3.19
  Bottom 0.152: X2.14 41.91,30.8 42.54,30.16 v42.54,16.51 42.54,10.79 41.91,10.16 X1.14 | v16.19,16.83 15.56,16.19 9.84,16.19 v8.89,17.14 3.81,22.22 v3.81,32.07
D5  (via drill 0.3)
  Top 0.152: X1.15 v44.45,11.11 | v44.45,29.84 X2.15 | IC1.19 v10.16,17.14 | v15.24,17.14 15.56,17.46 25.08,17.46 26.03,16.51 29.84,16.51 31.11,17.78 43.18,17.78 v44.45,16.51 45.08,15.88 50.8,15.88 51.75,14.92 58.38,14.92 IC2.8 | v5.08,44.45 IC3.13
  Bottom 0.152: v44.45,11.11 v44.45,16.51 v44.45,29.84 | v15.24,17.14 14.6,16.51 10.79,16.51 v10.16,17.14 4.45,22.86 4.45,43.82 v5.08,44.45
D6  (via drill 0.3)
  Top 0.152: IC3.20 v5.08,32.07 | v11.43,17.14 IC1.20 11.52,16.28 11.52,17.23 11.75,17.46 14.6,17.46 14.92,17.78 25.4,17.78 26.35,16.83 29.53,16.83 30.8,18.1 44.13,18.1 v45.08,17.14 46.04,16.19 51.12,16.19 52.07,15.24 57.99,15.24 IC2.7
  Bottom 0.152: X1.16 44.45,10.16 45.08,10.79 v45.08,17.14 45.08,30.16 44.45,30.8 X2.16 | v5.08,32.07 5.08,23.5 v11.43,17.14
D7  (via drill 0.3)
  Top 0.152: X2.17 v46.99,29.84 | X1.17 v46.99,11.11 | v12.7,18.1 IC1.21 25.72,18.1 26.67,17.14 29.21,17.14 30.48,18.41 45.72,18.41 v46.99,17.14 47.62,16.51 51.43,16.51 52.39,15.56 57.6,15.56 IC2.6 | v6.35,32.07 IC3.21
  Bottom 0.152: v46.99,29.84 v46.99,17.14 v46.99,11.11 | v12.7,18.1 11.75,18.1 6.35,23.5 v6.35,32.07
DB0  (via drill 0.3)
  Top 0.152: v84.14,19.68 IC9.10 77.47,19.68 73.98,23.18 72.3,23.18 IC2.33
  Bottom 0.152: v84.14,19.68 84.14,32.7 85.72,34.29 85.72,38.74 91.12,44.13 95.57,44.13 IC4.10
DB1  (via drill 0.3)
  Top 0.152: v82.87,19.05 82.55,19.05 81.91,18.41 IC9.11 77.79,18.41 73.66,14.29 68.54,14.29 IC2.24
  Bottom 0.152: IC4.11 93.34,44.45 90.81,44.45 85.41,39.05 85.41,34.61 83.5,32.7 83.5,19.68 v82.87,19.05
DB2  (via drill 0.3)
  Top 0.152: IC9.13 v83.82,17.14 82.55,15.88 76.52,15.88 74.3,13.65 67.77,13.65 IC2.22
  Bottom 0.152: IC4.12 91.12,44.77 89.53,44.77 83.5,38.74 83.5,33.97 82.23,32.7 82.23,18.73 v83.82,17.14
DB3  (via drill 0.3)
  Top 0.152: 87.95,18.41 IC9.14 82.87,18.41 v81.6,17.14 80.64,16.19 76.2,16.19 73.98,13.97 68.15,13.97 IC2.23
  Bottom 0.152: IC4.13 83.19,39.37 83.19,34.29 81.6,32.7 v81.6,17.14
DB4  (via drill 0.3)
  Top 0.152: IC9.15 87.95,19.68 87.31,20.32 v80.96,20.32 77.47,20.32 74.3,23.5 71.91,23.5 IC2.34
  Bottom 0.152: v80.96,20.32 80.96,32.7 82.87,34.61 82.87,40.01 84.45,41.59 IC4.15
DB5  (via drill 0.3)
  Top 0.152: IC9.16 87.95,20.95 87.31,21.59 v80.33,21.59 76.83,21.59 74.61,23.81 71.52,23.81 IC2.35
  Bottom 0.152: v80.33,21.59 80.33,32.7 81.91,34.29 IC4.1
DB6  (via drill 0.3)
  Top 0.152: v82.87,22.86 76.83,22.86 75.25,24.45 70.8,24.45 69.53,23.18 68.76,23.18 IC2.38 | v82.87,22.86 87.31,22.86 87.95,22.22 IC9.17 | v82.87,22.86 83.82,22.86
  Bottom 0.152: IC4.2 84.45,34.29 82.87,32.7 v82.87,22.86
DB7  (via drill 0.3)
  Top 0.152: IC9.18 87.95,23.5 87.31,24.13 v84.77,24.13 76.2,24.13 75.56,24.77 70.48,24.77 69.53,23.81 68.69,23.81 IC2.39
  Bottom 0.152: IC4.3 86.36,37.47 86.36,34.29 84.77,32.7 v84.77,24.13
E  (via drill 0.3)
  Top 0.152: v33.02,15.56 36.19,15.56 37.78,13.97 48.89,13.97 49.85,13.02 61.43,13.02 IC2.15
  Bottom 0.152: X1.6 31.75,10.16 32.38,10.79 32.38,15.56 | v33.02,15.56 32.38,15.56 | 32.38,15.56 32.38,30.16 31.75,30.8 X2.6
GND  (via drill 0.3, 0.36, 0.8)
  Top 0.152: VR1.1 7.3,9.86 v7.3,10.48
  Top 1.27: X2.34 v67.31,29.84 | v67.31,10.79 X1.34
  Bottom 0.152: C4.2.2 98.25,21.77 IC15.11
  Bottom 1.27: v67.31,29.84 X2.34 | X1.34 v67.31,10.79
  other vias: 98.42,30.48 25.65,13.61 21.27,14.99 25.65,12.74 5.08,13.97 12.7,21.91 10.16,32.07 61.59,23.81 60.64,16.19 65.41,21.59 65.41,15.24 66.36,23.5 1.27,44.45 98.11,21.59 63.5,12.7 78.1,17.14 77.47,34.29 24.13,34.29 100.97,0.64 92.07,0.64 100.97,46.67 80.64,46.67 76.52,13.97
  pour Top (rank 2): 24.45,2.54 24.45,13.97 10.16,13.97 10.16,0 0,0 0,47.31 21.59,47.31 21.59,34.93 80.01,34.93 80.01,47.31 101.6,47.31 101.6,0 91.44,0 91.44,13.97 77.15,13.97 77.15,2.54 arc-90 75.88,1.27 25.72,1.27 arc-90
  pour Bottom (rank 2): 24.45,2.54 24.45,13.97 10.16,13.97 10.16,0 0,0 0,47.31 21.59,47.31 21.59,34.93 80.01,34.93 80.01,47.31 101.6,47.31 101.6,0 91.44,0 91.44,13.97 77.15,13.97 77.15,2.54 arc-90 75.88,1.27 25.72,1.27 arc-90
N$1
  Top 0.152: IC6.3 85.82,44.55 IC4.14
N$2  (via drill 0.3)
  Top 0.152: C2.- C1.- v96.52,34.61
  Bottom 0.152: v96.52,34.61 R1.1
N$3  (via drill 0.3)
  Top 0.152: v90.49,34.61 C2.+
  Bottom 0.152: R2.2 v90.49,34.61
N$6
  Top 0.152: IC9.23 89.53,29.84 90.49,28.89 94.3,28.89 94.61,29.21 IC10.5
N$7
  Top 0.152: IC9.21 89.53,27.3 90.81,28.57 95.25,28.57 95.88,29.21 IC10.4
N$9  (via drill 0.3)
  Top 0.152: C17.- C7.- v93.98,7.3
  Bottom 0.152: R10.1 v93.98,7.3
N$10  (via drill 0.3)
  Top 0.152: IC9.20 89.53,26.04 v90.81,27.3 | v90.81,30.48 IC10.8
  Bottom 0.152: v90.81,27.3 v90.81,30.48
N$11  (via drill 0.3)
  Top 0.152: IC9.19 89.53,24.77 v92.07,27.3 | v92.07,30.48 IC10.7
  Bottom 0.152: v92.07,27.3 v92.07,30.48
N$12  (via drill 0.3)
  Top 0.152: IC9.24 v88.27,31.11
  Bottom 0.152: v88.27,31.11 87.66,31.11 IC5.3
N$13  (via drill 0.3)
  Top 0.152: C19.- C18.- v99.06,7.3
  Bottom 0.152: v99.06,7.3 R11.1
N$14  (via drill 0.3)
  Top 0.152: v94.61,24.13 IC10.12
  Bottom 0.152: R9.2 v94.61,24.13
N$15  (via drill 0.3)
  Top 0.152: v93.98,13.33 C17.+
  Bottom 0.152: R12.2 v93.98,13.33
N$16  (via drill 0.3)
  Top 0.152: v99.06,13.33 C19.+
  Bottom 0.152: R13.2 v99.06,13.33
N$17  (via drill 0.3)
  Top 0.152: v100.33,14.61 99.38,15.56 IC15.6 99.38,17.46 100.65,18.73 100.65,32.38 99.69,33.34 v95.25,33.34
  Bottom 0.152: R12.1 R13.1 100.33,11.59 v100.33,14.61 99.21,15.72 98.89,15.72 R16.2 | v95.25,33.34 94.77,33.34 R2.1
N$18  (via drill 0.3)
  Top 0.152: v93.03,20.64 91.44,19.05 IC14.2 IC14.1
  Bottom 0.152: v93.03,20.64 94.61,22.22 R9.1
N$19  (via drill 0.3)
  Top 0.152: IC10.10 v92.07,24.13 IC14.12
  Bottom 0.152: C4.6.1 v92.07,24.13
N$20  (via drill 0.3)
  Top 0.152: IC10.11 v93.34,24.13 IC14.10
  Bottom 0.152: C4.5.1 v93.34,24.13
N$21
  Top 0.152: IC15.1 IC15.2 96.84,15.88 97.16,15.56 98.42,15.56 98.74,15.88 IC15.5
N$23  (via drill 0.3)
  Top 0.152: IC10.13 v95.88,24.13 95.88,23.18 95.25,22.54 95.25,20.32 94.61,19.68 93.03,19.68 92.07,18.73 IC14.3
  Bottom 0.152: C4.4.1 v95.88,24.13
N$24  (via drill 0.3)
  Top 0.152: IC15.3 v97.47,18.41
  Bottom 0.152: R14.2 98.09,18.41 v97.47,18.41 97.46,18.4 C15.2.1 R15.1
N$26
  Top 0.152: IC10.14 97.16,23.18 96.84,22.86 96.2,22.86 95.57,22.22 95.57,17.78 94.61,16.83 IC14.7 IC14.6
N$27  (via drill 0.3)
  Top 0.152: v100.01,17.14 IC15.7 | C20.- v77.15,27.3
  Bottom 0.152: v100.01,17.14 99.69,17.46 97.96,17.46 R16.1 96.05,15.41 95.25,14.61 93.34,14.61 91.44,16.51 79.69,16.51 79.06,17.14 79.06,27.3 78.42,27.94 77.79,27.94 v77.15,27.3
N$28  (via drill 0.3)
  Top 0.152: IC14.5 93.34,16.83 v94.61,18.1 | v99.69,24.13 IC10.16
  Bottom 0.152: v94.61,18.1 94.61,20.32 96.52,22.22 | 96.52,22.22 98.11,23.81 99.38,23.81 v99.69,24.13 | C4.2.1 96.52,22.22
Q  (via drill 0.3)
  Top 0.152: X2.7 v34.29,29.84 | v34.29,11.11 X1.7
  Bottom 0.152: v34.29,29.84 34.29,21.59 | 34.29,21.59 v34.29,11.11 | J3.1 34.29,21.59
R/!W  (via drill 0.3)
  Top 0.152: v47.62,17.78 48.58,16.83 51.75,16.83 52.7,15.88 57.21,15.88 IC2.5
  Bottom 0.152: X1.18 46.99,10.16 47.62,10.79 v47.62,17.78 47.62,30.16 46.99,30.8 X2.18
READY  (via drill 0.3)
  Top 0.152: IC2.42 68.47,25.72 73.03,25.72 73.98,26.67 84.77,26.67 v85.41,27.3
  Bottom 0.152: v85.41,27.3 85.41,32.7 89.53,36.83 IC4.4 IC4.5 J1.2 | J1.2 SJ1.2 | R3.2 91.11,41.29 J1.2
SN_CH_0
  Bottom 0.152: R1.2 99.53,35.73 IC4.7
SND  (via drill 0.3)
  Top 0.152: X1.35 69.85,10.48 v69.22,11.11 | v69.22,29.84 69.85,30.48 X2.35 | C20.+ v69.22,27.3
  Bottom 0.152: v69.22,11.11 69.22,20.95 69.85,21.59 69.85,26.67 v69.22,27.3 v69.22,29.84
TCK  (via drill 0.36)
  Top 0.152: IC2.30 67.31,19.76 TCK.TP
  other vias: 67.31,19.68
TDI  (via drill 0.36)
  Top 0.152: IC2.28 67.88,17.78 TDI.TP
  other vias: 65.41,17.78
TDO  (via drill 0.36)
  Top 0.152: TDO.TP 62.55,24.45 61.21,24.45 IC2.53
  other vias: 63.5,23.5
TMS  (via drill 0.36)
  Top 0.152: IC2.29 67.32,19.05 64.13,19.05 TMS.TP
  other vias: 63.5,19.68
YMF_CH_0  (via drill 0.3)
  Top 0.152: IC14.13 IC14.14 90.81,21.27 90.17,20.64 90.17,15.88 92.71,13.33 v92.71,5.71
  Bottom 0.152: R10.2 93.98,4.45 v92.71,5.71
YMF_CH_1  (via drill 0.3)
  Top 0.152: IC14.8 IC14.9 v93.98,20.64 | v94.61,15.24 96.52,13.33 96.52,6.98 v97.79,5.71
  Bottom 0.152: v93.98,20.64 93.98,15.88 v94.61,15.24 | v97.79,5.71 99.06,4.45 R11.2